# EAGLE design transf_auto7 (EAGLE 5.04)
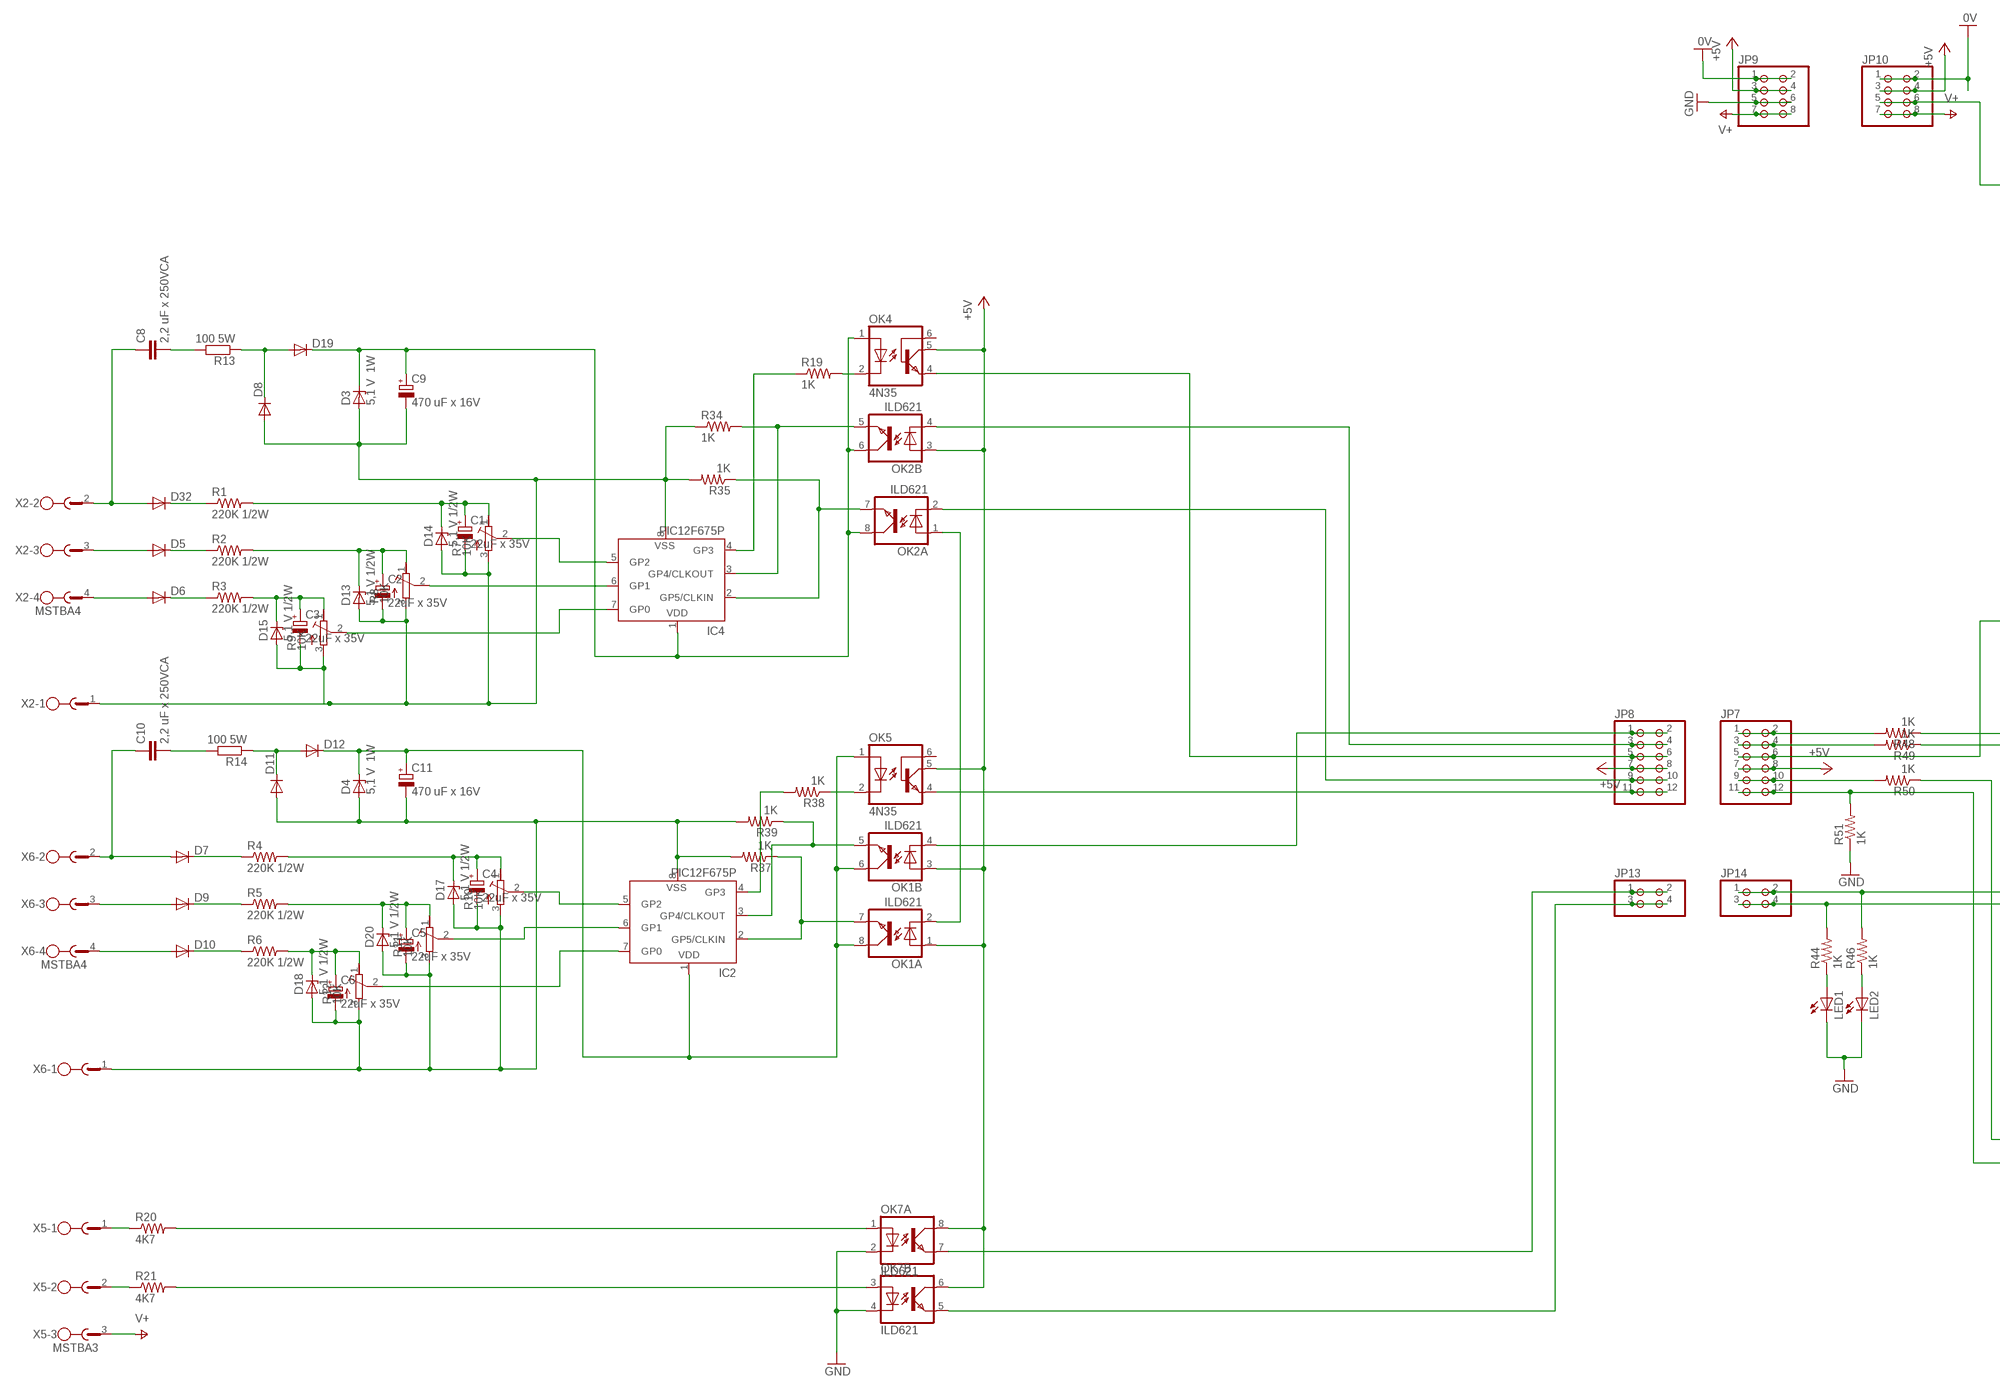
[diagram p0: schematic, sheet 1, part 1 of 2]
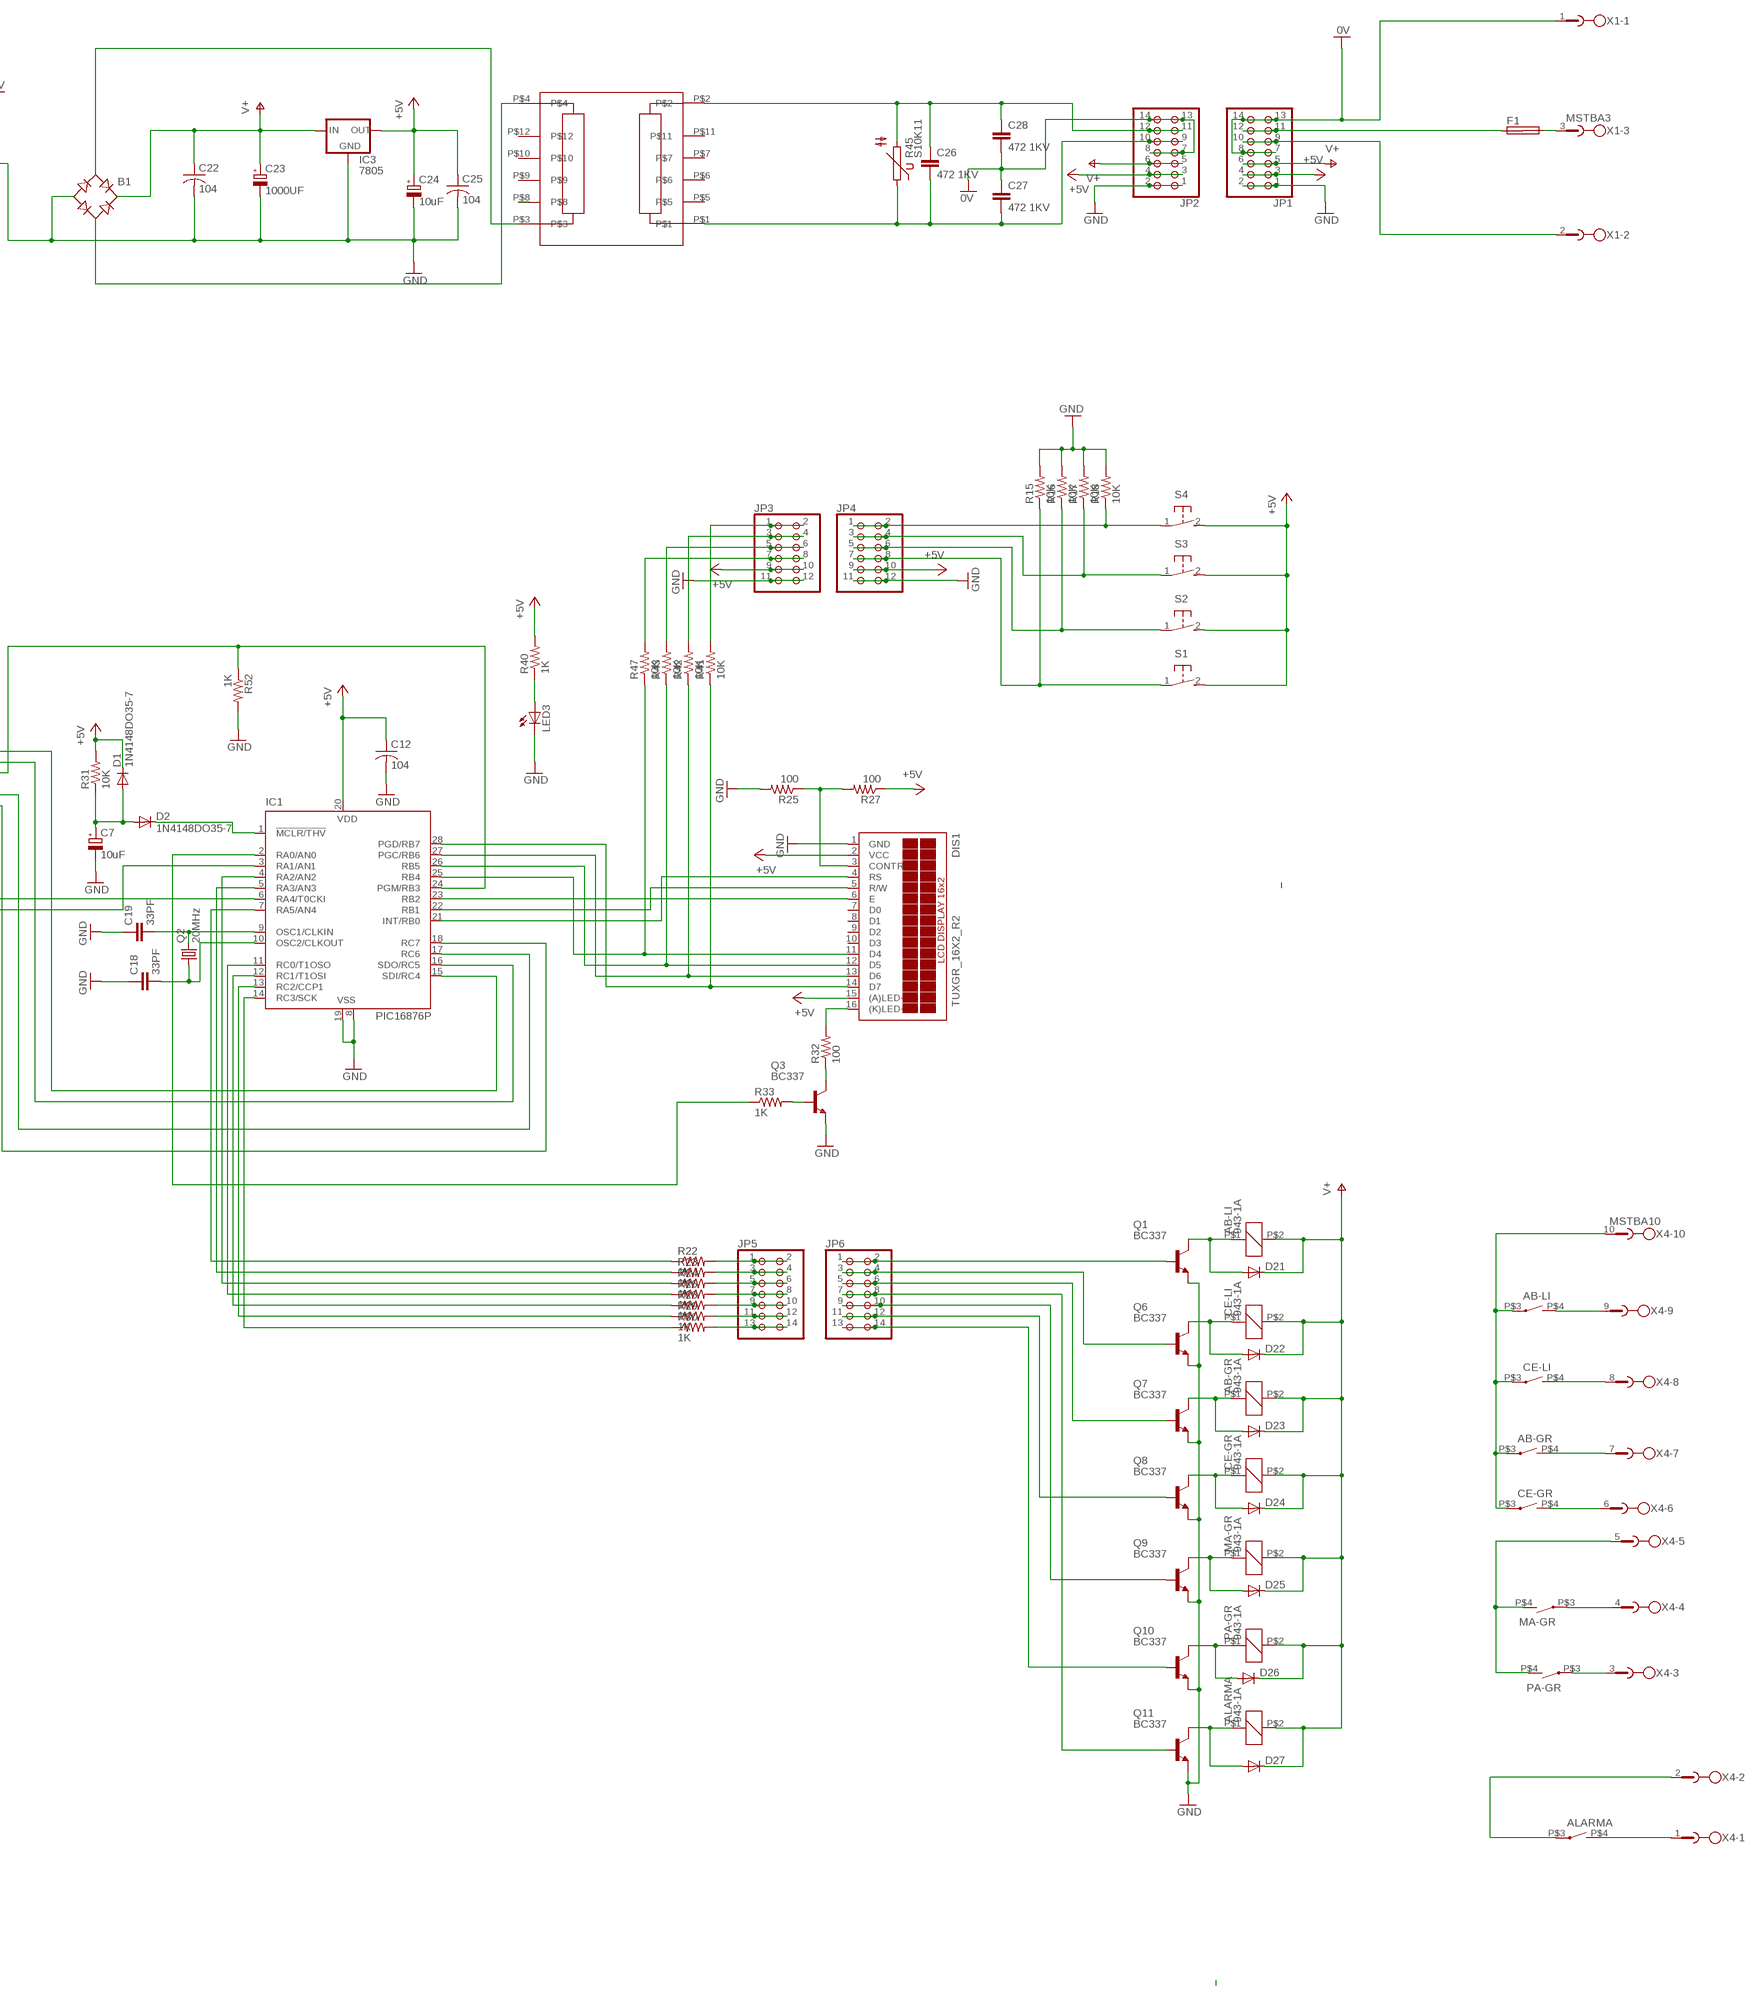
[diagram p1: schematic, sheet 1, part 2 of 2]

## Parts
AB-GR  943-1A  [943-1A]
AB-LI  943-1A  [943-1A]
ALARMA  943-1A  [943-1A]
B1  RB1A  [RB1A]
C1  22uF x 35V  CPOL-EUE2.5-6  [E2,5-6]
C2  22uF x 35V  CPOL-EUE2.5-6  [E2,5-6]
C3  22uF x 35V  CPOL-EUE2.5-6  [E2,5-6]
C4  22uF x 35V  CPOL-EUE2.5-6  [E2,5-6]
C5  22uF x 35V  CPOL-EUE2.5-6  [E2,5-6]
C6  22uF x 35V  CPOL-EUE2.5-6  [E2,5-6]
C7  10uF  CPOL-EUE2.5-6  [E2,5-6]
C8  2,2 uF x 250VCA  C-EU275-093X316  [C275-093X316]
C9  470 uF x 16V  CPOL-EUE3.5-8  [E3,5-8]
C10  2,2 uF x 250VCA  C-EU275-093X316  [C275-093X316]
C11  470 uF x 16V  CPOL-EUE3.5-8  [E3,5-8]
C12  104  C-US050-025X075  [C050-025X075]
C18  33PF  C-EU050-024X044  [C050-024X044]
C19  33PF  C-EU050-024X044  [C050-024X044]
C22  104  C-US050-025X075  [C050-025X075]
C23  1000UF  CPOL-EUE5-13  [E5-13]
C24  10uF  CPOL-EUE2.5-6  [E2,5-6]
C25  104  C-US050-025X075  [C050-025X075]
C26  472 1KV  C-EU050-025X075  [C050-025X075]
C27  472 1KV  C-EU050-025X075  [C050-025X075]
C28  472 1KV  C-EU050-025X075  [C050-025X075]
CE-GR  943-1A  [943-1A]
CE-LI  943-1A  [943-1A]
D1  1N4148DO35-7  [DO35-7]
D2  1N4148DO35-7  [DO35-7]
D3  5,1 V 1W  ZENER-DIODEZD-5  [ZDIO-5]
D4  5,1 V 1W  ZENER-DIODEZD-5  [ZDIO-5]
D5  DIODE-SOD80C  [SOD80C]
D6  DIODE-SOD80C  [SOD80C]
D7  DIODE-SOD80C  [SOD80C]
D8  DIODE-SOD80C  [SOD80C]
D9  DIODE-SOD80C  [SOD80C]
D10  DIODE-SOD80C  [SOD80C]
D11  DIODE-SOD80C  [SOD80C]
D12  DIODE-SOD80C  [SOD80C]
D13  5,1 V 1/2W  ZENER-DIODEZD-5  [ZDIO-5]
D14  5,1 V 1/2W  ZENER-DIODEZD-5  [ZDIO-5]
D15  5,1 V 1/2W  ZENER-DIODEZD-5  [ZDIO-5]
D17  5,1 V 1/2W  ZENER-DIODEZD-5  [ZDIO-5]
D18  5,1 V 1/2W  ZENER-DIODEZD-5  [ZDIO-5]
D19  DIODE-SOD80C  [SOD80C]
D20  5,1 V 1/2W  ZENER-DIODEZD-5  [ZDIO-5]
D21  DIODE-SOD80C  [SOD80C]
D22  DIODE-SOD80C  [SOD80C]
D23  DIODE-SOD80C  [SOD80C]
D24  DIODE-SOD80C  [SOD80C]
D25  DIODE-SOD80C  [SOD80C]
D26  DIODE-SOD80C  [SOD80C]
D27  DIODE-SOD80C  [SOD80C]
D32  DIODE-SOD80C  [SOD80C]
DIS1  TUXGR_16X2_R2  [TUXGR_16X2_R2]
F1  SHK20Q  [SHK20Q]
IC1  PIC16876P  [DIL28-3]
IC2  PIC12F675P  [DIL8]
IC3  7805  78XXS  [78XXS]
IC4  PIC12F675P  [DIL8]
JP1  PINHD-2X7  [2X07]
JP2  PINHD-2X7  [2X07]
JP3  PINHD-2X6  [2X06]
JP4  PINHD-2X6  [2X06]
JP5  PINHD-2X7  [2X07]
JP6  PINHD-2X7  [2X07]
JP7  PINHD-2X6  [2X06]
JP8  PINHD-2X6  [2X06]
JP9  PINHD-2X4  [2X04]
JP10  PINHD-2X4  [2X04]
JP13  PINHD-2X2  [2X02]
JP14  PINHD-2X2  [2X02]
LED1  LED5MM  [LED5MM]
LED2  LED5MM  [LED5MM]
LED3  LED5MM  [LED5MM]
MA-GR  943-1A  [943-1A]
OK1  ILD621  [DIL08]
OK2  ILD621  [DIL08]
OK4  4N35  [DIL06]
OK5  4N35  [DIL06]
OK7  ILD621  [DIL08]
PA-GR  943-1A  [943-1A]
Q1  BC337  [TO92]
Q2  20MHz  CRYTALHC49U70  [HC49U70]
Q3  BC337  [TO92]
Q6  BC337  [TO92]
Q7  BC337  [TO92]
Q8  BC337  [TO92]
Q9  BC337  [TO92]
Q10  BC337  [TO92]
Q11  BC337  [TO92]
R1  220K 1/2W  R-US_0204/5  [0204/5]
R2  220K 1/2W  R-US_0204/5  [0204/5]
R3  220K 1/2W  R-US_0204/5  [0204/5]
R4  220K 1/2W  R-US_0204/5  [0204/5]
R5  220K 1/2W  R-US_0204/5  [0204/5]
R6  220K 1/2W  R-US_0204/5  [0204/5]
R7  10K  R-TRIMMT93YA  [RTRIMT93YA]
R8  10K  R-TRIMMT93YA  [RTRIMT93YA]
R9  10K  R-TRIMMT93YA  [RTRIMT93YA]
R10  10K  R-TRIMMT93YA  [RTRIMT93YA]
R11  10K  R-TRIMMT93YA  [RTRIMT93YA]
R12  10K  R-TRIMMT93YA  [RTRIMT93YA]
R13  100 5W  R-EU_0309/12  [0309/12]
R14  100 5W  R-EU_0309/12  [0309/12]
R15  10K  R-US_0204/5  [0204/5]
R16  10K  R-US_0204/5  [0204/5]
R17  10K  R-US_0204/5  [0204/5]
R18  10K  R-US_0204/5  [0204/5]
R19  1K  R-US_0204/5  [0204/5]
R20  4K7  R-US_0204/5  [0204/5]
R21  4K7  R-US_0204/5  [0204/5]
R22  1K  R-US_0204/5  [0204/5]
R23  1K  R-US_0204/5  [0204/5]
R24  1K  R-US_0204/5  [0204/5]
R25  100  R-US_0204/5  [0204/5]
R26  1K  R-US_0204/5  [0204/5]
R27  100  R-US_0204/5  [0204/5]
R28  1K  R-US_0204/5  [0204/5]
R29  1K  R-US_0204/5  [0204/5]
R30  1K  R-US_0204/5  [0204/5]
R31  10K  R-US_0204/5  [0204/5]
R32  100  R-US_0204/5  [0204/5]
R33  1K  R-US_0204/5  [0204/5]
R34  1K  R-US_0204/5  [0204/5]
R35  1K  R-US_0204/5  [0204/5]
R37  1K  R-US_0204/5  [0204/5]
R38  1K  R-US_0204/5  [0204/5]
R39  1K  R-US_0204/5  [0204/5]
R40  1K  R-US_0204/5  [0204/5]
R41  10K  R-US_0204/7  [0204/7]
R42  10K  R-US_0204/7  [0204/7]
R43  10K  R-US_0204/7  [0204/7]
R44  1K  R-US_0204/5  [0204/5]
R45  S10K11  [S10K11]
R46  1K  R-US_0204/5  [0204/5]
R47  10K  R-US_0204/7  [0204/7]
R48  1K  R-US_0204/5  [0204/5]
R49  1K  R-US_0204/5  [0204/5]
R50  1K  R-US_0204/5  [0204/5]
R51  1K  R-US_0204/5  [0204/5]
R52  1K  R-US_0204/5  [0204/5]
S1  31-XX  [B3F-31XX]
S2  31-XX  [B3F-31XX]
S3  31-XX  [B3F-31XX]
S4  31-XX  [B3F-31XX]
U$18  EI25_12/0  [EI25_12/0-PLACA]
X1  MSTBA3  [MSTBA3]
X2  MSTBA4  [MSTBA4]
X4  MSTBA10  [MSTBA10]
X5  MSTBA3  [MSTBA3]
X6  MSTBA4  [MSTBA4]

## Nets
0V: C27.1 C28.2 JP1.7 JP1.8 JP1.13 JP1.14 JP2.7 JP2.8 JP2.13 JP2.14 JP9.1 JP9.2 JP10.1 JP10.2 X1.1
+5V: C12.1 C24.+ C25.1 D1.C DIS1.2(VCC) DIS1.15((A)LED-) IC1.20(VDD) IC3.OUT JP1.3 JP1.4 JP2.3 JP2.4 JP3.9 JP3.10 JP4.9 JP4.10 JP7.7 JP7.8 JP8.7 JP8.8 JP9.3 JP9.4 JP10.3 JP10.4 OK1.1(A:A) OK1.3(B:A) OK2.3(B:A) OK4.5(COL) OK5.5(COL) OK7.6(B:COL) OK7.8(A:COL) R27.1 R31.2 R40.2 S1.2(S) S2.2(S) S3.2(S) S4.2(S)
GND: B1.- C7.- C12.2 C18.1 C19.1 C22.2 C23.- C24.- C25.2 DIS1.1(GND) IC1.8(VSS) IC1.19(VSS) IC3.GND JP1.1 JP1.2 JP2.1 JP2.2 JP3.11 JP3.12 JP4.11 JP4.12 JP9.5 JP9.6 JP10.5 JP10.6 LED1.K(C) LED2.K(C) LED3.K(C) OK7.2(A:C) OK7.4(B:C) Q1.1(E) Q3.1(E) Q6.1(E) Q7.1(E) Q8.1(E) Q9.1(E) Q10.1(E) Q11.1(E) R15.2 R16.2 R17.2 R18.2 R25.2 R51.1 R52.2
N$1: C1.+ D14.C R1.2 R7.1(A)
N$2: C1.- C2.- C3.- C9.- D3.A D8.A D13.A D14.A D15.A IC4.8(VSS) R7.3(E) R8.3(E) R9.3(E) R34.1 R35.2 X2.1
N$3: F1.2A X1.3
N$4: C2.+ D13.C R2.2 R8.1(A)
N$5: IC4.5(GP2) R7.2(S)
N$6: C3.+ D15.C R3.2 R9.1(A)
N$7: IC4.7(GP0) R9.2(S)
N$8: D5.A X2.3
N$9: D6.C R3.1
N$10: D6.A X2.4
N$11: D5.C R2.1
N$12: C8.1 D32.A X2.2
N$13: D32.C R1.1
N$14: D9.A X6.3
N$15: IC4.6(GP1) R8.2(S)
N$16: C4.+ D17.C R4.2 R10.1(A)
N$17: B1.AC1 U$18.P$3
N$18: OK4.2(C) R19.2
N$19: IC4.3(GP4/CLKOUT) OK2.5(B:EMIT) R34.2
N$20: IC4.2(GP5/CLKIN) OK2.7(A:EMIT) R35.1
N$21: C9.+ D3.C D19.C IC4.1(VDD) OK2.6(B:COL) OK2.8(A:COL) OK4.1(A)
N$22: C4.- C5.- C6.- C11.- D4.A D11.A D17.A D18.A D20.A IC2.8(VSS) R10.3(E) R11.3(E) R12.3(E) R37.2 R39.2 X6.1
N$23: JP8.5 JP8.6 OK4.4(EMI)
N$24: B1.AC2 U$18.P$4
N$25: C5.+ D20.C R5.2 R11.1(A)
N$26: C8.2 R13.2
N$27: C6.+ D18.C R6.2 R12.1(A)
N$28: D8.C D19.A R13.1
N$29: JP8.3 JP8.4 OK2.4(B:C)
N$30: D10.C R6.1
N$31: D9.C R5.1
N$32: AB-GR.P$3(P) AB-LI.P$3(P) CE-GR.P$3(P) CE-LI.P$3(P) X4.10
N$33: D7.C R4.1
N$34: JP8.9 JP8.10 OK2.2(A:C)
N$35: C10.1 D7.A X6.2
N$36: D10.A X6.4
N$37: JP3.1 JP3.2 R41.2
N$38: OK5.2(C) R38.1
N$39: D2.C IC1.1(!MCLR/THV)
N$40: C18.2 IC1.10(OSC2/CLKOUT) Q2.1
N$41: JP8.1 JP8.2 OK1.4(B:C)
N$42: C19.2 IC1.9(OSC1/CLKIN) Q2.2
N$43: JP6.1 JP6.2 Q1.2(B)
N$44: DIS1.16((K)LED-) R32.2
N$45: DIS1.14(D7) IC1.28(PGD/RB7) R41.1
N$47: DIS1.13(D6) IC1.27(PGC/RB6) R42.1
N$48: U$18.P$8
N$49: AB-GR.P$4(S) X4.7
N$51: AB-LI.P$4(S) X4.9
N$52: CE-LI.P$4(S) X4.8
N$53: MA-GR.P$4(S) PA-GR.P$4(S) X4.5
N$54: JP6.3 JP6.4 Q6.2(B)
N$55: JP6.5 JP6.6 Q7.2(B)
N$56: JP6.7 JP6.8 Q11.2(B)
N$57: IC2.5(GP2) R10.2(S)
N$58: CE-GR.P$4(S) X4.6
N$59: C7.+ D1.A D2.A R31.1
N$60: C26.1 C28.1 JP2.11 JP2.12 R45.2 U$18.P$2
N$61: JP6.9 JP6.10 Q9.2(B)
N$62: MA-GR.P$3(P) X4.4
N$63: JP13.1 JP13.2 OK7.7(A:EMIT)
N$64: IC2.7(GP0) R12.2(S)
N$66: JP1.9 JP1.10 X1.2
N$67: LED1.A R44.1
N$68: DIS1.3(CONTR) R25.1 R27.2
N$69: JP3.7 JP3.8 R47.2
N$70: JP3.5 JP3.6 R43.2
N$71: DIS1.12(D5) IC1.26(RB5) R43.1
N$72: DIS1.11(D4) IC1.25(RB4) R47.1
N$74: DIS1.4(RS) IC1.21(INT/RB0)
N$75: DIS1.5(R/W) IC1.22(RB1)
N$76: DIS1.6(E) IC1.23(RB2)
N$77: IC1.17(RC6) R50.1
N$78: IC1.16(SDO/RC5) R49.1
N$79: IC1.15(SDI/RC4) R48.1
N$80: F1.1A JP1.11 JP1.12
N$82: IC1.18(RC7) JP7.11 JP7.12 R51.2
N$83: IC4.4(GP3) R19.1
N$84: JP5.1 JP5.2 R22.2
N$85: LED2.A R46.1
N$86: Q3.3(C) R32.1
N$87: Q3.2(B) R33.2
N$88: C26.2 C27.2 JP2.9 JP2.10 R45.1 U$18.P$1
N$90: PA-GR.P$3(P) X4.3
N$92: ALARMA.P$3(P) X4.2
N$93: JP6.11 JP6.12 Q8.2(B)
N$94: R21.1 X5.2
N$95: JP6.13 JP6.14 Q10.2(B)
N$96: IC1.14(RC3/SCK) R30.1
N$97: IC1.13(RC2/CCP1) R29.1
N$98: IC1.12(RC1/T1OSI) R28.1
N$99: IC1.11(RC0/T1OSO) R26.1
N$100: IC1.4(RA2/AN2) R24.1
N$101: IC1.5(RA3/AN3) R23.1
N$102: JP4.7 JP4.8 R15.1 S1.1(P)
N$103: JP4.5 JP4.6 R16.1 S2.1(P)
N$104: JP4.3 JP4.4 R17.1 S3.1(P)
N$105: JP4.1 JP4.2 R18.1 S4.1(P)
N$106: IC1.7(RA5/AN4) R22.1
N$107: R20.1 X5.1
N$118: IC2.2(GP5/CLKIN) OK1.7(A:EMIT) R37.1
N$119: IC2.4(GP3) R38.2
N$120: ALARMA.P$4(S) X4.1
N$121: IC2.3(GP4/CLKOUT) OK1.5(B:EMIT) R39.1
N$122: OK7.1(A:A) R20.2
N$123: OK7.3(B:A) R21.2
N$124: ALARMA.P$1 D27.A Q11.3(C)
N$125: C11.+ D4.C D12.C IC2.1(VDD) OK1.6(B:COL) OK1.8(A:COL) OK5.1(A)
N$126: D11.C D12.A R14.1
N$127: C10.2 R14.2
N$128: D26.A PA-GR.P$1 Q10.3(C)
N$129: IC2.6(GP1) R11.2(S)
N$130: IC1.6(RA4/T0CKI) JP14.1 JP14.2 R46.2
N$133: D25.A MA-GR.P$1 Q9.3(C)
N$137: IC1.3(RA1/AN1) JP14.3 JP14.4 R44.2
N$138: CE-GR.P$1 D24.A Q8.3(C)
N$139: JP13.3 JP13.4 OK7.5(B:EMIT)
N$140: AB-GR.P$1 D23.A Q7.3(C)
N$141: JP5.3 JP5.4 R23.2
N$142: CE-LI.P$1 D22.A Q6.3(C)
N$143: JP5.5 JP5.6 R24.2
N$144: AB-LI.P$1 D21.A Q1.3(C)
N$145: JP5.7 JP5.8 R26.2
N$146: JP5.9 JP5.10 R28.2
N$147: JP5.11 JP5.12 R29.2
N$148: JP5.13 JP5.14 R30.2
N$149: OK1.2(A:C) OK2.1(A:A)
N$151: JP7.1 JP7.2 R48.2
N$152: IC1.2(RA0/AN0) R33.1
N$153: JP7.3 JP7.4 R49.2
N$154: JP7.9 JP7.10 R50.2
N$155: LED3.A R40.1
N$156: JP3.3 JP3.4 R42.2
N$157: JP8.11 JP8.12 OK5.4(EMI)
N$158: IC1.24(PGM/RB3) JP7.5 JP7.6 R52.1
V+: AB-GR.P$2 AB-LI.P$2 ALARMA.P$2 B1.+ C22.1 C23.+ CE-GR.P$2 CE-LI.P$2 D21.C D22.C D23.C D24.C D25.C D26.C D27.C IC3.IN JP1.5 JP1.6 JP2.5 JP2.6 JP9.7 JP9.8 JP10.7 JP10.8 MA-GR.P$2 PA-GR.P$2 X5.3
Unconnected: DIS1.7(D0) DIS1.8(D1) DIS1.9(D2) DIS1.10(D3) F1.1B F1.2B OK4.6(BAS) OK5.6(BAS) U$18.P$5 U$18.P$6 U$18.P$7 U$18.P$9 U$18.P$10 U$18.P$11 U$18.P$12

## Library data of the parts
AB-GR AB-LI ALARMA CE-GR CE-LI MA-GR PA-GR = relay:943-1A
B1 = rectifier:RB1A: RECTIFIER 1 A
C1-C7 C9 C11 C23 C24 = rcl:CPOL-EU: POLARIZED CAPACITOR, European symbol
C8 C10 C18 C19 C26-C28 = rcl:C-EU: CAPACITOR, European symbol
C12 C22 C25 = rcl:C-US: CAPACITOR, American symbol
D1 D2 = diode:1N4148: DIODE high speed (Philips)
D3 D4 D13-D15 D17 D18 D20 = diode:ZENER-DIODE: Z-Diode
D5-D12 D19 D21-D27 D32 = diode:DIODE-: DIODE
DIS1 = display-lcd:TUXGR_16X2_R2: Tuxgraphics LCD display 16x2 characters reflective, without background light Source: tuxgr_12x2_r2.pdf
F1 = fuse:SHK20Q: FUSE HOLDER 5 x 20 mm, SH contact, E1207 Buerklin 64G6061
IC1 = microchip:PIC16*876: MICROCONTROLLER flash type
IC2 IC4 = microchip:PIC12F6*: Data Sheet 8-Pin FLASH-Based 8-Bit CMOS Microcontrollers Source: http://www.microchip.com .. 41190c.pdf
IC3 = v-reg:78XXS: VOLTAGE REGULATOR
JP1 JP2 JP5 JP6 = pinhead:PINHD-2X7: PIN HEADER
JP3 JP4 JP7 JP8 = pinhead:PINHD-2X6: PIN HEADER
JP9 JP10 = pinhead:PINHD-2X4: PIN HEADER
JP13 JP14 = pinhead:PINHD-2X2: PIN HEADER
LED1-LED3 = led:LED: LED OSRAM: - CHIPLED LG R971, LG N971, LY N971, LG Q971, LY Q971, LO R971, LY R971 LH N974, LH R974 LS Q976, LO Q976, LY Q976 LO Q996 - Hyper CHIPLED LW Q18S LB Q993, LB Q99A, LB R99A - SideLED LS A670, LO A670, LY A670, LG A670, LP A670 LB A673, LV A673, LT A673, LW A673 LH A674 LY A675 LS A676, LA A676, LO A676, LY A676, LW A676 LS A679, LY A679, LG A679 - Hyper Micro SIDELED® LS Y876, LA Y876, LO Y876, LY Y876 LT Y87S - SmartLED LW L88C, LW L88S LB L89C, LB L89S, LG L890 LS L89K, LO L89K, LY L89K LS L896, LA L896, LO L896, LY L896 - TOPLED LS T670, LO T670, LY T670, LG T670, LP T670 LSG T670, LSP T670, LSY T670, LOP T670, LYG T670 LG T671, LOG T671, LSG T671 LB T673, LV T673, LT T673, LW T673 LH T674 LS T676, LA T676, LO T676, LY T676, LB T676, LH T676, LSB T676, LW T676 LB T67C, LV T67C, LT T67C, LS T67K, LO T67K, LY T67K, LW E67C LS E67B, LA E67B, LO E67B, LY E67B, LB E67C, LV E67C, LT E67C LW T67C LS T679, LY T679, LG T679 LS T770, LO T770, LY T770, LG T770, LP T770 LB T773, LV T773, LT T773, LW T773 LH T774 LS E675, LA E675, LY E675, LS T675 LS T776, LA T776, LO T776, LY T776, LB T776 LHGB T686 LT T68C, LB T68C - Hyper Mini TOPLED® LB M676 - Mini TOPLED Santana® LG M470 LS M47K, LO M47K, LY M47K Source: http://www.osram.convergy.de LUXEON: - LUMILED® LXK2-PW12-R00, LXK2-PW12-S00, LXK2-PW14-U00, LXK2-PW14-V00 LXK2-PM12-R00, LXK2-PM12-S00, LXK2-PM14-U00 LXK2-PE12-Q00, LXK2-PE12-R00, LXK2-PE12-S00, LXK2-PE14-T00, LXK2-PE14-U00 LXK2-PB12-K00, LXK2-PB12-L00, LXK2-PB12-M00, LXK2-PB14-N00, LXK2-PB14-P00, LXK2-PB14-Q00 LXK2-PR12-L00, LXK2-PR12-M00, LXK2-PR14-Q00, LXK2-PR14-R00 LXK2-PD12-Q00, LXK2-PD12-R00, LXK2-PD12-S00 LXK2-PH12-R00, LXK2-PH12-S00 LXK2-PL12-P00, LXK2-PL12-Q00, LXK2-PL12-R00 Source: www.luxeon.com KINGBRIGHT: KA-3528ASYC Source: www.kingbright.com
OK1 OK2 OK7 = optocoupler:ILD621: SIEMENS OPTO COUPLER
OK4 OK5 = optocoupler:4N35: MOTOROLA OPTO COUPLER
Q1 Q3 Q6-Q11 = transistor-npn:BC337*: NPN Transistor
Q2 = crystal:CRYTAL: CRYSTAL
R1-R6 R15-R35 R37-R44 R46-R52 = rcl:R-US_: RESISTOR, American symbol
R7-R12 = rcl:R-TRIMM: Trimm resistor
R13 R14 = rcl:R-EU_: RESISTOR, European symbol
R45 = varistor:S10K11: VARISTOR
S1-S4 = switch-omron:31-XX: OMRON SWITCH
U$18 = trafo:EI25_12/0
X1 X5 = con-phoenix-508:MSTBA3: PHOENIX
X2 X6 = con-phoenix-508:MSTBA4: PHOENIX
X4 = con-phoenix-508:MSTBA10: PHOENIX

## Board
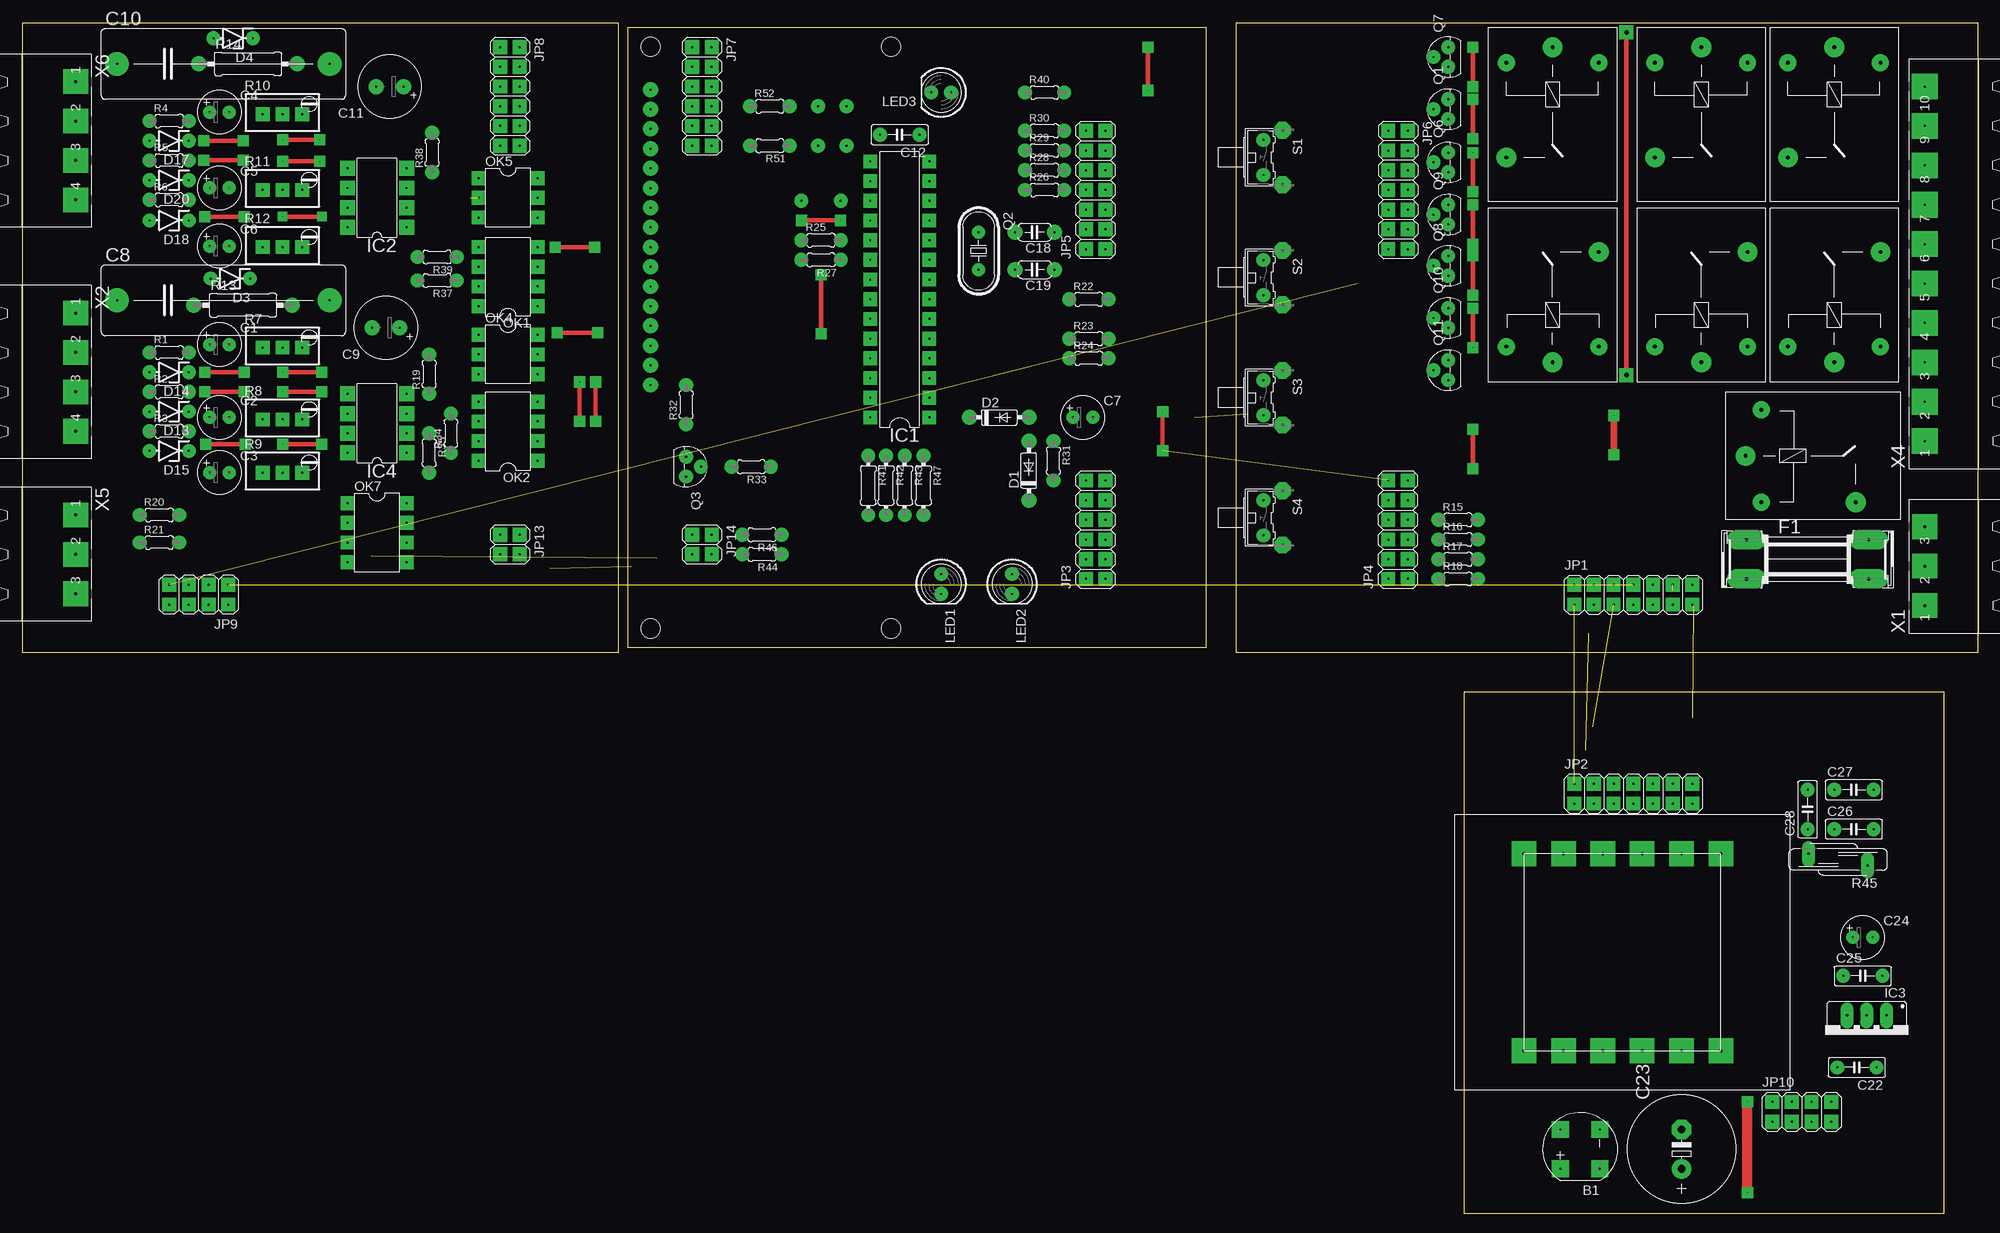
[diagram p2: board, top side]
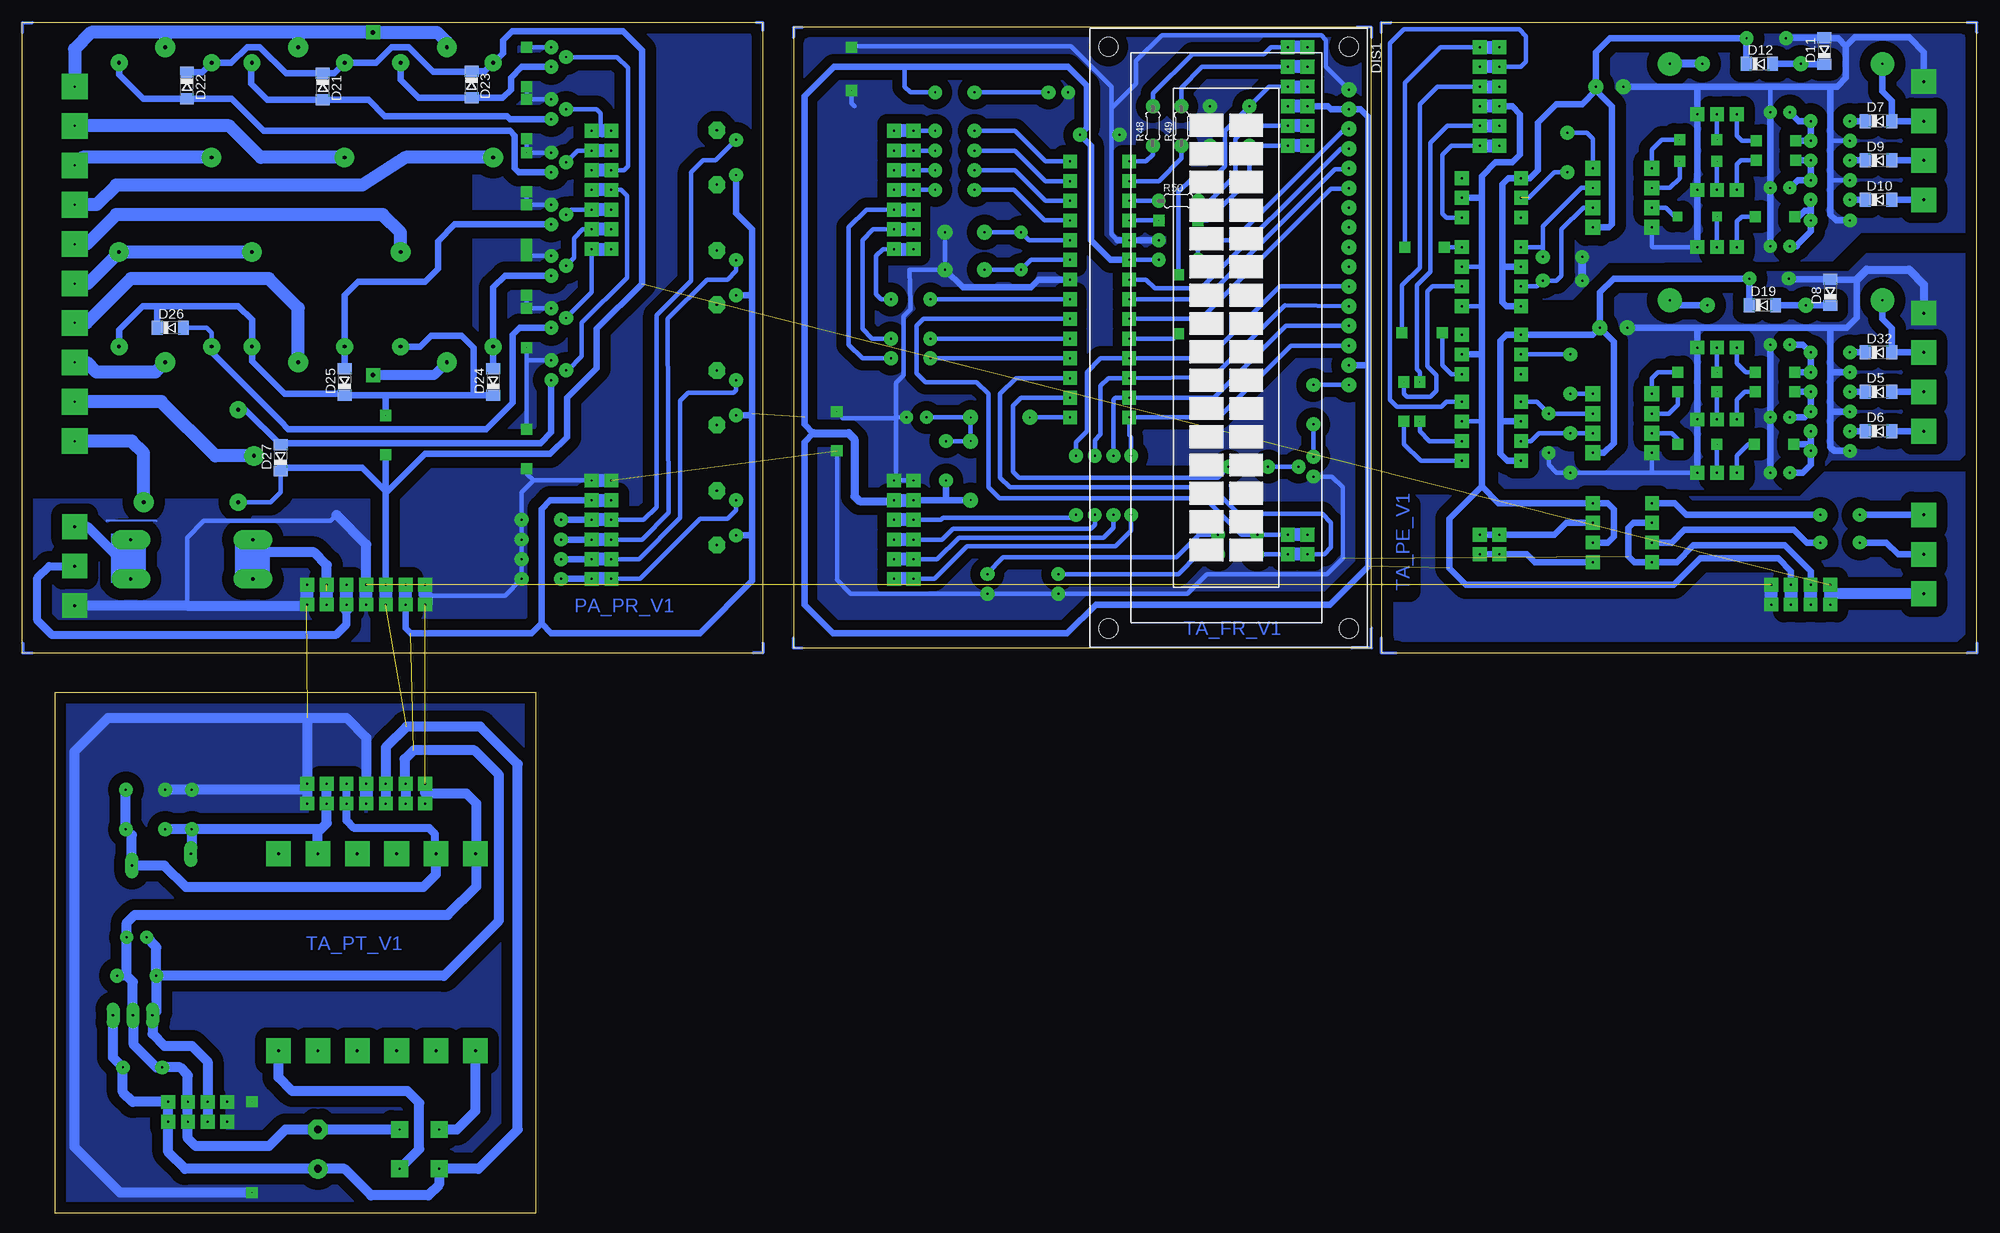
[diagram p3: board, bottom side, seen from below]

Size 252.22 x 153.54 mm. Coordinates in mm from the lower left corner, seen from the top.
Outline: 0,72.26 0,153.54 76.84,153.54 76.84,72.26 0,72.26
Outline: 78.1,72.9 78.1,152.91 152.65,152.91 152.65,72.9 78.1,72.9
Outline: 156.59,72.26 156.59,153.54 252.22,153.54 252.22,72.26 156.59,72.26
Outline: 185.93,67.18 185.93,0 247.9,0 247.9,67.18 185.93,67.18
Copper layers (1*16): Top 0.035mm / dielectric 1.5mm / Bottom 0.035mm
Design rules "default": minimum track width 10mil, minimum drill 24mil, track to track 8mil, track to pad 8mil, pad to pad 8mil, via to via 8mil, smd to smd 8mil, copper to edge 40mil, drill to drill 8mil, minimum pad ring 10mil, minimum via ring 8mil, stop-mask expansion 4mil, vias tented up to drill 0mil, thermal gap 10mil

### Footprints (pad centres in the part's own frame; a part is rotated, then mirrored left to right if it is on the bottom)
943-1A = drill 0.5 pad 2.184 round: P$1 -6.858,5.969; P$2 -6.858,-5.969 | drill 0.5 pad 2.54 round: P$3 -8.89,0; P$4 5.334,-5.969
RB1A = drill 0.254 pad 2.184 square: + -2.54,2.54; - 2.54,-2.54; AC1 2.54,2.54; AC2 -2.54,-2.54
E2,5-6 = drill 0.254 pad 1.676 round: + -1.27,0; - 1.27,0
C275-093X316 = drill 0.254 pad 3.048 round: 1 -13.716,0; 2 13.716,0
E3,5-8 = drill 0.254 pad 1.93 round: + -1.778,0; - 1.778,0
C050-025X075 = drill 0.254 pad 1.778 round: 1 -2.54,0; 2 2.54,0
C050-024X044 = drill 0.254 pad 1.93 round: 1 -2.54,0; 2 2.54,0
E5-13 = drill 1.016 pad 2.54 round: + -2.54,0 | drill 1.016 pad 2.54 octagon: - 2.54,0
DO35-7 = drill 0.2 pad 1.93 round: A 3.81,0; C -3.81,0
ZDIO-5 = drill 0.254 pad 1.778 round: A 2.54,0; C -2.54,0
SOD80C = smd 1.4 x 1.8: A 1.7,0; C -1.7,0
TUXGR_16X2_R2 = drill 0.254 pad 1.93 round: 1 -32,15.5; 2 -29.46,15.5; 3 -26.92,15.5; 4 -24.38,15.5; 5 -21.84,15.5; 6 -19.3,15.5; 7 -16.76,15.5; 8 -14.22,15.5; 9 -11.68,15.5; 10 -9.14,15.5; 11 -6.6,15.5; 12 -4.06,15.5; 13 -1.52,15.5; 14 1.02,15.5; 15 3.56,15.5; 16 6.1,15.5 | hole 2.5: -37.5,-15.5; 37.5,-15.5; -37.5,15.5; 37.5,15.5
SHK20Q = drill 0.406 pad 2.54 long: 1A -7.874,2.54; 1B -7.874,-2.54; 2A 7.874,2.54; 2B 7.874,-2.54
DIL28-3 = drill 0.254 pad 1.778 square: 1 -16.51,-3.81; 2 -13.97,-3.81; 3 -11.43,-3.81; 4 -8.89,-3.81; 5 -6.35,-3.81; 6 -3.81,-3.81; 7 -1.27,-3.81; 8 1.27,-3.81; 9 3.81,-3.81; 10 6.35,-3.81; 11 8.89,-3.81; 12 11.43,-3.81; 13 13.97,-3.81; 14 16.51,-3.81; 15 16.51,3.81; 16 13.97,3.81; 17 11.43,3.81; 18 8.89,3.81; 19 6.35,3.81; 20 3.81,3.81; 21 1.27,3.81; 22 -1.27,3.81; 23 -3.81,3.81; 24 -6.35,3.81; 25 -8.89,3.81; 26 -11.43,3.81; 27 -13.97,3.81; 28 -16.51,3.81
DIL8 = drill 0.254 pad 1.93 square: 1 -3.81,-3.81; 2 -1.27,-3.81; 3 1.27,-3.81; 4 3.81,-3.81; 5 3.81,3.81; 6 1.27,3.81; 7 -1.27,3.81; 8 -3.81,3.81
78XXS = drill 0.305 pad 1.676 long: GND 0,-2.54; IN -2.54,-2.54; OUT 2.54,-2.54
2X07 = drill 0.254 pad 1.778 square: 1 -7.62,-1.27; 2 -7.62,1.27; 3 -5.08,-1.27; 4 -5.08,1.27; 5 -2.54,-1.27; 6 -2.54,1.27; 7 0,-1.27; 8 0,1.27; 9 2.54,-1.27; 10 2.54,1.27; 11 5.08,-1.27; 12 5.08,1.27; 13 7.62,-1.27; 14 7.62,1.27
2X06 = drill 0.254 pad 1.778 square: 1 -6.35,-1.27; 2 -6.35,1.27; 3 -3.81,-1.27; 4 -3.81,1.27; 5 -1.27,-1.27; 6 -1.27,1.27; 7 1.27,-1.27; 8 1.27,1.27; 9 3.81,-1.27; 10 3.81,1.27; 11 6.35,-1.27; 12 6.35,1.27
2X04 = drill 0.254 pad 1.778 square: 1 -3.81,-1.27; 2 -3.81,1.27; 3 -1.27,-1.27; 4 -1.27,1.27; 5 1.27,-1.27; 6 1.27,1.27; 7 3.81,-1.27; 8 3.81,1.27
2X02 = drill 0.254 pad 1.778 square: 1 -1.27,-1.27; 2 -1.27,1.27; 3 1.27,-1.27; 4 1.27,1.27
LED5MM = drill 0.254 pad 1.778 round: A -1.27,0; K 1.27,0
DIL08 = drill 0.254 pad 1.778 square: 1 -3.81,-3.81; 2 -1.27,-3.81; 3 1.27,-3.81; 4 3.81,-3.81; 5 3.81,3.81; 6 1.27,3.81; 7 -1.27,3.81; 8 -3.81,3.81
DIL06 = drill 0.254 pad 1.778 square: 1 -2.54,-3.81; 2 0,-3.81; 3 2.54,-3.81; 4 2.54,3.81; 5 0,3.81; 6 -2.54,3.81
TO92 = drill 0.254 pad 1.778 round: 1 1.27,0; 2 0,1.905; 3 -1.27,0
HC49U70 = drill 0.254 pad 1.676 round: 1 -2.413,0; 2 2.413,0
0204/5 = drill 0.254 pad 1.778 round: 1 -2.54,0; 2 2.54,0
RTRIMT93YA = drill 0.254 pad 1.778 square: 1 0,-2.54; 2 0,0; 3 0,2.54
0309/12 = drill 0.254 pad 1.93 round: 1 -6.35,0; 2 6.35,0
0204/7 = drill 0.254 pad 1.778 round: 1 -3.81,0; 2 3.81,0
S10K11 = drill 0.305 pad 1.676 long: 1 -0.762,-3.81; 2 0.762,3.81
B3F-31XX = drill 0.254 pad 1.778 round: 1 -2.261,-1.245; 2 2.261,-1.245 | drill 0.305 pad 2.159 octagon: 3 -3.505,1.245; 4 3.505,1.245
EI25_12/0-PLACA = drill 0.381 pad 3.175 square: P$1 -12.7,-7.62; P$2 -12.7,7.62; P$3 12.7,-12.7; P$4 12.7,12.7; P$5 -12.7,12.7; P$6 -12.7,-12.7; P$7 -12.7,-2.54; P$8 -12.7,2.54; P$9 12.7,-7.62; P$10 12.7,-2.54; P$11 12.7,2.54; P$12 12.7,7.62
MSTBA3 = drill 0.381 pad 3.175 square: 1 -5.08,5.08; 2 0,5.08; 3 5.08,5.08
MSTBA4 = drill 0.381 pad 3.175 square: 1 -7.62,5.08; 2 -2.54,5.08; 3 2.54,5.08; 4 7.62,5.08
MSTBA10 = drill 0.254 pad 3.302 square: 1 -22.86,5.08; 2 -17.78,5.08; 3 -12.7,5.08; 4 -7.62,5.08; 5 -2.54,5.08; 6 2.54,5.08; 7 7.62,5.08; 8 12.7,5.08; 9 17.78,5.08; 10 22.86,5.08

### Placement (x,y rotation side)
AB-GR  197.36,141.48 270 top
AB-LI  216.53,141.48 270 top
ALARMA  231.14,97.66 0 top
B1  200.91,8.26 90 top
C1  25.4,112.01 0 top
C2  25.4,102.62 0 top
C3  25.4,95.5 0 top
C4  25.4,141.99 0 top
C5  25.4,132.21 0 top
C6  25.4,124.71 0 top
C7  136.78,102.62 0 top
C8  25.91,117.73 0 top
C9  46.86,114.17 180 top
C10  25.91,148.21 0 top
C11  47.37,145.29 180 top
C12  113.16,139.06 180 top
C18  130.56,126.49 180 top
C19  130.56,121.67 180 top
C22  236.6,18.8 180 top
C23  214,8.26 90 top
C24  237.36,35.56 0 top
C25  237.36,30.61 0 top
C26  236.22,49.53 0 top
C27  236.22,54.61 0 top
C28  230.25,52.07 90 top
CE-GR  197.36,118.62 90 top
CE-LI  233.68,141.48 270 top
D1  129.79,95.76 90 top
D2  125.98,102.62 0 top
D3  26.8,120.52 180 top
D4  27.18,151.51 180 top
D5  12.7,105.92 0 bottom
D6  12.7,100.84 0 bottom
D7  12.7,140.84 0 bottom
D8  18.92,118.75 90 bottom
D9  12.7,135.76 0 bottom
D10  12.7,130.68 0 bottom
D11  19.69,149.86 90 bottom
D12  28.07,148.21 0 bottom
D13  18.92,103.38 180 top
D14  18.92,108.46 180 top
D15  18.92,98.3 180 top
D17  18.92,138.3 180 top
D18  18.92,128.02 180 top
D19  27.69,117.09 0 bottom
D20  18.92,133.22 180 top
D21  213.36,145.29 270 bottom
D22  230.89,145.42 270 bottom
D23  194.18,145.54 270 bottom
D24  191.39,107.19 90 bottom
D25  210.57,107.19 90 bottom
D26  233.04,114.17 0 bottom
D27  218.82,97.41 90 bottom
D32  12.7,111 0 bottom
DIS1  96.52,112.9 270 bottom
F1  230.25,84.33 0 top
IC1  113.16,119.13 90 top
IC2  45.72,130.94 90 top
IC3  237.87,22.99 180 top
IC4  45.72,101.85 90 top
JP1  207.77,79.76 0 top
JP2  207.77,54.1 0 top
JP3  138.43,88.14 90 top
JP4  177.42,88.14 90 top
JP5  138.43,131.95 90 top
JP6  177.42,131.95 270 top
JP7  87.63,144.02 270 top
JP8  62.87,144.02 270 top
JP9  22.73,79.76 180 top
JP10  229.49,13.08 0 top
JP13  62.87,86.23 270 top
JP14  87.63,86.23 270 top
LED1  118.49,81.15 270 top
LED2  127.64,81.15 270 top
LED3  118.49,144.53 180 top
MA-GR  216.53,118.62 90 top
OK1  62.61,120.78 90 top
OK2  62.61,100.84 90 top
OK4  62.61,110.74 270 top
OK5  62.61,130.94 270 top
OK7  45.72,87.76 270 top
PA-GR  233.68,118.62 90 top
Q1  183.9,142.37 90 top
Q2  123.32,124.08 270 top
Q3  85.6,96.27 270 top
Q6  183.9,135.51 90 top
Q7  183.9,149.1 90 top
Q8  183.9,122.17 90 top
Q9  183.9,128.78 90 top
Q10  183.9,115.44 90 top
Q11  183.9,108.71 90 top
R1  18.92,111 0 top
R2  18.92,105.92 0 top
R3  18.92,100.84 0 top
R4  18.92,140.84 0 top
R5  18.92,135.76 0 top
R6  18.92,130.68 0 top
R7  33.53,111.63 270 top
R8  33.53,102.36 270 top
R9  33.53,95.5 270 top
R10  33.53,141.73 270 top
R11  33.53,131.95 270 top
R12  33.53,124.59 270 top
R13  28.45,117.09 0 top
R14  29.08,148.21 0 top
R15  185.17,89.41 0 top
R16  185.17,86.87 0 top
R17  185.17,84.33 0 top
R18  185.17,81.79 0 top
R19  52.45,108.2 90 top
R20  17.65,90.04 0 top
R21  17.65,86.49 0 top
R22  137.54,117.86 0 top
R23  137.54,112.78 0 top
R24  137.54,110.24 0 top
R25  103,125.48 0 top
R26  131.83,131.95 0 top
R27  103,122.94 180 top
R28  131.83,134.49 0 top
R29  131.83,137.03 0 top
R30  131.83,139.57 0 top
R31  132.97,97.03 270 top
R32  85.6,104.27 90 top
R33  93.98,96.27 180 top
R34  55.24,100.58 90 top
R35  52.45,98.04 270 top
R37  53.47,120.27 180 top
R38  52.83,136.78 90 top
R39  53.47,123.32 180 top
R40  131.83,144.53 0 top
R41  109.09,93.85 270 top
R42  111.38,93.85 270 top
R43  113.79,93.85 270 top
R44  95.38,84.96 180 top
R45  234.19,45.59 90 top
R46  95.38,87.5 180 top
R47  116.21,93.85 270 top
R48  106.3,140.21 90 bottom
R49  102.62,140.21 90 bottom
R50  103,130.56 0 bottom
R51  96.39,137.67 180 top
R52  96.39,142.75 0 top
S1  161.29,136.14 270 top
S2  161.29,120.65 270 top
S3  161.29,105.16 270 top
S4  161.29,89.66 270 top
U$18  206.38,33.66 270 top
X1  250.44,83.44 90 top
X2  1.78,108.46 270 top
X4  250.44,122.43 90 top
X5  1.78,84.96 270 top
X6  1.78,138.3 270 top

### Tracks (layer width: path | path; a pad name or v marks a point on that pad's centre or on a via)
0V  (via drill 0.01 pad 1.42)  (2 unrouted)
  Top 1.27: v222.5,2.67 v222.5,14.35
  Bottom 0.254: 234.82,89.28 241.3,89.28
  Bottom 0.61: 211.58,90.04 212.34,89.28 228.73,89.28 230.89,87.12 230.89,78.36
  Bottom 1.27: C27.1 C28.2 215.39,54.61 JP2.14 | JP2.14 JP2.13 | X1.1 230.89,78.36 215.52,78.36 JP1.13 | v222.5,2.67 239.52,2.67 245.36,8.51 245.36,59.56 241.05,63.88 215.39,63.88 | JP2.8 207.77,61.34 210.31,63.88 215.39,63.88 | 215.39,63.88 JP2.14 | JP1.8 207.77,86.23 211.58,90.04
  Bottom 1.676: JP1.13 JP1.14 | JP2.8 JP2.7 | JP1.7 JP1.8 | JP9.2 JP9.1
  pour Bottom (isolate 1.422, no thermals): 1.4,95.5 19.69,95.5 22.86,92.33 44.96,92.33 75.82,92.58 75.82,73.28 3.05,73.28 1.4,74.93
  pour Bottom (isolate 1.422, no thermals): 252.22,72.26 252.22,92.08 207.39,92.08 207.39,72.26
  pour Bottom (isolate 1.422, no thermals): 185.93,67.18 185.93,0 248.03,0 248.03,67.18
+5V  (3 unrouted)
  Bottom 0.61: 157.99,87.38 158.01,87.4 | 157.99,103.12 158.22,102.89 | 157.99,118.49 158.09,118.39 | IC1.20 R27.1 | 139.83,91.82 JP3.9 | 133.1,91.95 132.97,92.08 | R40.2 137.54,144.53 138.3,145.29 138.3,147.57 138.56,147.83 | 63.88,122.05 OK1.3 | 63.88,116.97 OK1.1 | OK2.3 64.01,102.11 63.88,101.98 | 63.88,112.14 64.01,112.01
  Bottom 0.813: S1.2 160.05,128.93 157.99,126.87 157.99,118.49 157.99,103.12 157.99,87.38 157.99,81.53 164.72,74.8 183.9,74.8 185.17,76.07 | 158.01,87.4 S4.2 | 158.22,102.89 S3.2 | 158.09,118.39 S2.2 | JP8.7 59.94,142.75 58.93,141.73 58.93,136.53 59.94,135.51 62.1,135.51 63.88,133.73 63.88,130.94 | JP4.9 184.02,91.95 185.17,90.8 185.17,76.07 | JP1.3 202.69,75.44 202.06,74.8 186.44,74.8 185.17,76.07 | IC1.20 111.76,122.94 114.3,125.48 114.3,137.67 C12.1 114.81,139.95 114.81,145.42 117.22,147.83 138.56,147.83 147.45,147.83 151.26,144.02 151.26,102.62 151.26,101.73 150.11,100.58 151.26,99.44 151.26,78.49 147.57,74.8 117.35,74.8 113.67,78.49 83.44,78.49 78.49,83.44 78.49,109.47 | JP3.10 133.1,91.95 D1.C | 132.97,92.08 R31.2 | OK7.6 47.63,86.49 46.86,87.25 46.86,90.8 47.63,91.57 OK7.8 61.72,91.57 63.88,93.73 | 63.88,93.73 63.88,101.98 63.88,110.74 | 63.88,110.74 63.88,112.14 63.88,116.97 63.88,122.05 63.88,130.94 | 63.88,130.94 OK5.5 | 63.88,110.74 OK4.5 | DIS1.15 78.62,109.34 78.49,109.47 | 78.49,109.47 78.49,141.35 79.5,142.37 DIS1.2 83.31,142.36 83.69,142.75 JP7.7 | 63.88,93.73 68.07,89.54 68.07,83.19 65.91,81.03 39.12,81.03 35.69,84.45 25.65,84.45 24,82.8 JP9.3
  Bottom 1.016: 139.83,91.82 144.15,91.82 144.78,92.46 144.78,99.82 145.54,100.58 150.11,100.58
  Bottom 1.27: JP2.3 JP2.4 202.82,55.5 202.82,58.55 201.68,59.69 193.8,59.69 190.63,56.52 190.63,37.72 197.74,30.61 C25.1 | C25.1 234.82,26.04 IC3.OUT 235.33,23.11 233.81,21.59 230.25,21.59 228.22,19.56 JP10.4 JP10.3 | C25.1 234.82,34.29 C24.+
  Bottom 1.676: JP8.7 JP8.8 | JP4.9 JP4.10 | JP1.3 JP1.4 | JP3.9 JP3.10 | JP7.7 JP7.8 | JP9.3 JP9.4
GND  (via drill 0.01 pad 1.42)  (3 unrouted)
  Top 0.61: v187.07,145.29 v187.07,150.37 | v187.07,138.56 v187.07,143.64 | v187.07,131.7 v187.07,136.78 | v187.07,124.97 v187.07,130.05 | v187.07,118.36 v187.07,123.44 | v187.07,111.63 v187.07,116.71 | v187.07,96.01 v187.07,101.09 | v147.07,98.3 v147.07,103.38 | v145.16,150.37 v145.16,144.78
  Bottom 0.61: 110.87,125.48 111.63,126.24 111.63,139.19 | 111.63,142.49 111.63,139.19 | C18.1 C19.1 137.67,121.67 137.54,117.22 137.54,116.59 138.43,115.7 138.43,108.08 139.45,107.06 139.45,102.62 | 139.45,102.49 139.45,94.74 JP3.11 JP3.12 | 139.45,102.49 139.45,102.62 | v187.07,150.37 Q7.1 | v187.07,145.29 v187.07,143.64 Q1.1 | v187.07,138.56 v187.07,136.78 Q6.1 | v187.07,131.7 v187.07,130.05 Q9.1 | v187.07,124.97 v187.07,123.44 Q8.1 | v187.07,118.36 v187.07,116.71 Q10.1 | v187.07,101.09 187.07,109.98 | 187.07,109.98 v187.07,111.63 | 186.18,94.49 JP4.11 | 186.18,94.49 187.71,92.96 R15.2 R16.2 R17.2 R18.2 189.87,79.63 200.03,79.63 200.15,79.63 | 200.03,78.61 JP1.1 | 187.07,109.98 Q11.1 | 139.45,102.62 C7.- | v147.07,98.3 147.07,81.66 145.29,79.88 LED2.K LED1.K 101.85,79.88 99.31,82.42 83.82,82.42 81.79,84.45 81.79,93.6 83.19,95 Q3.1 85.47,94.87 | 139.45,102.49 146.3,102.49 | C12.2 111.51,139.06 111.63,139.19 | 111.63,142.49 111.63,145.29 116.84,150.5 145.03,150.5 v145.16,150.37 | v145.16,144.78 145.16,143.13 144.78,142.75 | DIS1.1 83.95,147.83 83.95,151.26 84.58,151.89 105.16,151.89 108.46,148.59 108.46,145.67 111.63,142.49 | v187.07,96.01 187.07,95.38 186.18,94.49
  Bottom 0.813: R25.2 IC1.19 110.87,125.48 | IC1.8 121.03,120.4 122.05,119.38 130.81,119.38 C19.1 | OK7.2 44.32,89.03 44.96,88.39 44.96,84.71 44.2,83.95 42.42,83.95 | 42.42,83.95 OK7.4 | JP9.5 21.46,82.8 24.77,86.11 36.58,86.11 38.74,83.95 42.42,83.95
  Bottom 1.27: 238.63,30.61 237.87,29.84 IC3.GND 237.74,25.4 237.74,21.72 234.82,18.8 C22.2 231.78,18.8 230.76,17.78 JP10.6 JP10.5 230.76,9.65 229.74,8.64 220.34,8.64 218.19,10.8 C23.- B1.- | 238.63,30.61 C24.- 238.63,37.47 237.62,38.48 197.23,38.48 193.55,42.16 193.55,52.83 194.82,54.1 200.03,54.1 | 238.63,30.61 C25.2 | 200.03,54.1 200.15,54.1 JP2.2 | JP2.1 200.03,52.83 200.03,54.1
  Bottom 1.676: 200.15,79.63 JP1.2 | 200.03,79.63 200.03,78.61 | JP4.11 JP4.12 | JP9.6 JP9.5
  pour Bottom (isolate 1.27, no thermals): 77.47,154.05 77.47,72.77 153.29,72.77 153.29,153.8
  pour Bottom (isolate 1.422, no thermals): 199.77,72.26 156.59,72.39 156.59,153.54 193.93,153.54 194.06,96.14 205.23,96.14 205.23,72.26
N$1  (via drill 0.01 pad 1.42)
  Top 0.61: v23.49,108.46 v28.58,108.46
  Bottom 0.61: v28.58,108.46 29.85,108.46 30.99,109.6 R7.1
  Bottom 0.813: v23.49,108.46 D14.C R1.2 22.48,112.01 C1.+
N$2
  Bottom 0.61: R9.3 41.91,95.5 | 41.91,95.5 IC4.8 | 41.91,95.5 R35.2 54.23,95.5 55.24,96.52 R34.1
  Bottom 0.813: D15.A 18.41,98.3 18.92,98.81 18.92,103.38 | 18.92,108.46 18.92,103.38 | 18.92,108.46 D14.A | 18.92,103.38 D13.A | C3.- C2.- C1.- | R9.3 R8.3 R7.3 36.07,114.17 | 18.92,114.17 18.92,108.46 | 18.92,114.17 36.07,114.17 | 36.07,114.17 C9.- | 18.92,114.17 16.76,114.17 15.49,115.44 15.49,120.4 18.87,120.4 D8.A 24.18,120.45 D3.A
  Bottom 1.016: X2.1 6.86,119.76 8.76,121.67 14.22,121.67 15.49,120.4
  pour Bottom (isolate 1.422, no thermals): 2.29,97.16 18.8,97.16 22.61,93.35 61.6,93.35 61.47,113.16 58.8,113.28 53.72,115.82 48.13,121.41 16.51,121.41 14.22,123.7 1.14,123.7 1.14,98.3
N$3
  Bottom 1.27: X1.3 243.71,88.52 240.16,84.96 238.25,84.96 238.13,85.09 F1.2A
N$4  (via drill 0.01 pad 1.42)
  Top 0.61: v23.49,105.92 v28.58,105.92
  Bottom 0.61: v28.58,105.92 29.97,105.92 30.99,104.9 R8.1
  Bottom 0.813: v23.49,105.92 R2.2 D13.C 22.23,102.62 C2.+
N$5  (via drill 0.01 pad 1.42)
  Top 0.61: v33.53,108.46 v38.61,108.46
  Bottom 0.61: R7.2 v33.53,108.46 | v38.61,108.46 41.15,108.46 41.91,107.7 IC4.5
N$6  (via drill 0.01 pad 1.42)
  Top 0.61: v23.62,99.19 v28.7,99.19
  Bottom 0.61: D15.C 21.46,99.19 | v28.7,99.19 29.46,99.19 30.99,97.66 R9.1
  Bottom 0.813: R3.2 D15.C 21.46,96.52 22.48,95.5 C3.+ | 21.46,99.19 v23.62,99.19
N$7  (via drill 0.01 pad 1.42)
  Top 0.61: v38.61,99.19 v33.53,99.19
  Bottom 0.61: v33.53,99.19 R9.2 | v38.61,99.19 38.61,99.82 39.37,100.58 IC4.7
N$8
  Bottom 0.813: X2.3 D5.A
N$9
  Bottom 0.813: D6.C R3.1
N$10
  Bottom 0.813: X2.4 D6.A
N$11
  Bottom 0.813: D5.C R2.1
N$12
  Bottom 0.813: X2.2 D32.A 11,114.12 12.19,115.32 C8.1
N$13
  Bottom 0.813: D32.C R1.1
N$14
  Bottom 0.813: X6.3 D9.A
N$15  (via drill 0.01 pad 1.42)
  Top 0.61: v38.61,105.92 v33.53,105.92
  Bottom 0.61: v33.53,105.92 R8.2 | v38.61,105.92 38.61,104.27 39.75,103.12 IC4.6
N$16  (via drill 0.01 pad 1.42)
  Top 0.61: v23.37,138.3 v28.45,138.3
  Bottom 0.61: v28.45,138.3 30.35,138.3 30.99,138.94 R10.1
  Bottom 0.813: v23.37,138.3 D17.C R4.2 22.99,140.84 C4.+
N$17
  Bottom 1.27: B1.AC1 196.09,10.8 193.68,13.21 U$18.P$3
N$18
  Bottom 0.61: R19.2 OK4.2
N$19
  Bottom 0.61: IC4.3 R34.2 56.77,104.65 OK2.5
N$20
  Bottom 0.61: OK2.7 57.53,99.57 56.52,100.58 R35.1 IC4.2
N$21
  Bottom 0.813: 61.47,102.23 61.47,97.92 60.58,97.03 OK2.8 | 61.47,102.23 61.47,112.52 60.71,113.28 OK4.1 49.53,113.28 C9.+ | OK2.6 61.34,102.11 61.47,102.23 | D19.C 29.39,120.47 D3.C 46.86,120.52 48.64,118.75 C9.+ | C9.+ 46.86,112.39 46.86,99.31 48.13,98.04 IC4.1
N$22
  Bottom 0.61: 26.67,145.29 C4.- | R12.3 41.78,124.59 41.91,124.71 IC2.8 | D17.A 18.92,138.3 18.92,138.68 | D20.A 18.92,133.22 18.92,133.48
  Bottom 0.813: C6.- C5.- C4.- | R12.3 R11.3 R10.3 36.07,145.29 | 16.89,150.5 16.89,146.43 18.03,145.29 18.92,145.29 | 16.89,150.5 17.91,151.51 19.64,151.51 D11.A 24.59,151.56 D4.A | 36.07,145.29 26.67,145.29 18.92,145.29 | 36.07,145.29 C11.- | X6.1 6.86,149.73 8.76,151.64 15.75,151.64 16.89,150.5 | D18.A 18.16,128.02 18.92,128.78 18.92,133.48 18.92,138.68 18.92,145.29
  Bottom 1.016: R37.2 R39.2
  pour Bottom (isolate 1.422, no thermals): 1.65,126.49 14.99,126.49 18.67,122.81 47.63,122.55 52.2,117.86 57.53,117.86 57.53,150.24 54.61,153.16 0.51,153.04 0.51,127.89
N$23  (via drill 0.01 pad 1.42)
  Top 0.61: v68.96,113.54 v74.17,113.54
  Bottom 0.61: JP8.6 69.6,145.29 71.88,143 71.88,121.92 74.17,119.63 v74.17,113.54 | v68.96,113.54 68.96,109.35 67.82,108.2 OK4.4
  Bottom 1.676: JP8.6 JP8.5
N$24
  Bottom 1.27: B1.AC2 200.91,8.26 200.91,14.22 202.44,15.75 217.3,15.75 219.08,17.53 U$18.P$4
N$25  (via drill 0.01 pad 1.42)
  Top 0.61: v23.37,135.76 v28.45,135.76
  Bottom 0.61: v28.45,135.76 30.48,135.76 30.99,135.25 R11.1
  Bottom 0.813: v23.37,135.76 R5.2 D20.C 23.11,133.22 C5.+
N$26
  Bottom 0.813: R13.2 38.99,117.09 C8.2
N$27  (via drill 0.01 pad 1.42)
  Top 0.61: v23.49,128.52 v28.58,128.52
  Bottom 0.61: v28.58,128.52 30.35,128.52 30.99,127.89 R12.1 | 23.24,124.84 23.24,124.71
  Bottom 0.813: 23.24,124.71 C6.+ | 23.24,124.84 21.46,126.62 D18.C 21.46,129.29 | 21.46,129.29 R6.2 | v23.49,128.52 22.99,128.52 22.23,129.29 21.46,129.29
N$28
  Bottom 0.813: D8.C 18.97,117.09 R13.1 D19.A
N$29
  Bottom 0.61: JP8.3 58.8,147.83 58.17,148.46 58.17,151.76 59.05,152.65 73.91,152.65 75.69,150.88 75.69,104.9 74.8,104.01 69.09,104.01 68.45,104.65 OK2.4
  Bottom 1.676: JP8.3 JP8.4
N$30
  Bottom 0.813: D10.C R6.1
N$31
  Bottom 0.813: D9.C R5.1
N$32  (via drill 0.6 pad 1.78)
  Top 0.61: v206.88,108.08 v206.88,152.27
  Bottom 1.27: 197.36,151 AB-GR.P$3 | v206.88,108.08 199.01,108.08 CE-GR.P$3
  Bottom 1.676: 216.53,152.27 233.68,152.27 | 233.68,152.27 243.21,152.27 245.36,150.11 X4.10 | 233.68,152.27 CE-LI.P$3 | 216.53,152.27 AB-LI.P$3 | 216.53,152.27 v206.88,152.27 198.63,152.27 197.36,151
N$33
  Bottom 0.813: D7.C R4.1
N$34  (via drill 0.01 pad 1.42)
  Top 0.61: v71.88,102.11 v71.88,107.19
  Bottom 0.61: JP8.10 68.33,140.21 70.49,138.05 70.49,121.41 72.26,119.63 72.26,108.84 71.88,108.46 v71.88,107.19 | OK2.2 70.61,99.57 71.88,100.84 v71.88,102.11
  Bottom 1.676: JP8.10 JP8.9
N$35
  Bottom 0.813: X6.2 D7.A 11,143.46 12.19,144.65 C10.1
N$36
  Bottom 0.813: X6.4 D10.A
N$37
  Bottom 0.61: R41.2 109.09,88.01 111.12,85.98 130.3,85.98 134.49,81.79 JP3.2
  Bottom 1.676: JP3.2 JP3.1
N$38  (1 unrouted)
  Bottom 0.61: R38.1 54.48,134.24 57.79,130.94
N$39
  Bottom 0.61: IC1.1 D2.C
N$40
  Bottom 0.61: IC1.10 122.3,125.48 Q2.1 C18.2
N$41  (via drill 0.01 pad 1.42)
  Top 0.61: v68.71,124.59 v73.79,124.59
  Bottom 0.61: JP8.2 69.22,150.37 73.79,145.8 v73.79,124.59 | OK1.4 v68.71,124.59
  Bottom 1.676: JP8.2 JP8.1
N$42
  Bottom 0.61: IC1.9 122.05,122.94 Q2.2 C19.2
N$43
  Bottom 0.61: Q1.2 178.05,142.37 177.55,141.86 177.55,139.83 177.29,139.57
  Bottom 1.676: JP6.1 177.29,139.57 JP6.2
N$44
  Bottom 0.61: DIS1.16 R32.2
N$45
  Bottom 0.61: DIS1.14 88.52,111.89 97.79,102.62 IC1.28 109.35,100.33 109.09,100.08 R41.1
N$47
  Bottom 0.61: DIS1.13 89.16,114.42 98.43,105.16 IC1.27 111.12,105.16 111.38,104.9 R42.1
N$49
  Bottom 1.676: AB-GR.P$4 202.69,136.14 208.28,132.59 240.03,132.59 242.57,130.05 X4.7
N$51
  Bottom 1.676: AB-LI.P$4 221.36,136.14 225.42,140.21 X4.9
N$52
  Bottom 1.27: 244.35,136.14 X4.8
  Bottom 1.676: CE-LI.P$4 244.35,136.14
N$53
  Bottom 1.27: 243.71,119.89 X4.5
  Bottom 1.676: 243.71,119.89 PA-GR.P$4 MA-GR.P$4
N$54
  Bottom 0.61: JP6.4 180.47,137.03 Q6.2
  Bottom 1.676: JP6.3 JP6.4
N$55
  Bottom 0.61: JP6.5 174.5,134.49 173.99,135 173.99,147.7 175.39,149.1 Q7.2
  Bottom 1.676: JP6.5 JP6.6
N$56
  Bottom 0.61: JP6.7 174.88,131.95 174.12,131.19 174.12,120.65 179.96,114.81 179.96,110.49 181.74,108.71 Q11.2
  Bottom 1.676: JP6.7 JP6.8
N$57  (via drill 0.01 pad 1.42)
  Top 0.61: v33.53,138.43 v38.35,138.43
  Bottom 0.61: v33.53,138.43 R10.2 | v38.35,138.43 40.64,138.43 41.91,137.16 IC2.5
N$58
  Bottom 1.27: 243.84,124.97 X4.6
  Bottom 1.676: 243.84,124.97 240.03,128.78 205.61,128.78 203.33,126.49 CE-GR.P$4
N$59
  Bottom 0.61: C7.+ D2.A D1.A R31.1
N$60
  Bottom 1.27: C28.1 C26.1 | R45.2 230.25,46.36 C28.1 | JP2.12 JP2.11 212.85,50.29 213.68,49.47 | U$18.P$2 214,49.15 213.68,49.47 | C28.1 213.68,49.53 213.68,49.47
N$61
  Bottom 0.61: JP6.10 181.36,129.41 Q9.2
  Bottom 1.676: JP6.9 JP6.10
N$62
  Bottom 1.27: 243.84,114.81 X4.4
  Bottom 1.676: MA-GR.P$3 216.53,116.71 220.34,120.52 238.13,120.52 243.84,114.81
N$63
  Bottom 0.813: JP13.2 JP13.1 54.48,87.5 52.96,89.03 OK7.7
N$64  (via drill 0.01 pad 1.27)
  Top 0.61: v33.53,128.52 v38.61,128.52
  Bottom 0.61: R12.2 v33.53,128.52 | v38.61,128.52 38.99,128.52 40.13,129.67 IC2.7
N$66
  Bottom 1.016: X1.2 248.67,83.44 250.19,81.92 250.19,76.45 248.28,74.55 211.71,74.55 210.31,75.95 210.31,77.98 JP1.9
  Bottom 1.676: 210.31,77.98 JP1.10
N$67
  Bottom 0.61: LED1.A 103,82.42 100.46,84.96 R44.1
N$68
  Bottom 0.61: DIS1.3 81.54,139.82 95.89,125.48 R25.1 R27.2
N$69
  Bottom 0.61: R47.2 116.59,89.66 133.35,89.66 133.6,89.41 JP3.8
  Bottom 1.676: JP3.8 JP3.7
N$70
  Bottom 0.61: JP3.6 133.48,86.87 132.08,88.27 114.3,88.27 113.79,88.77 R43.2
  Bottom 1.676: JP3.6 JP3.5
N$71
  Bottom 0.61: DIS1.12 89.28,117.09 98.55,107.82 IC1.26 112.01,107.7 113.03,106.68 113.03,100.46 113.79,99.7 R43.1
N$72
  Bottom 0.61: DIS1.11 89.92,119.51 99.19,110.24 IC1.25 113.03,110.24 114.81,108.46 114.81,100.84 116.21,99.44 R47.1
N$74
  Bottom 0.61: DIS1.4 82.05,137.28 100.08,119.25 106.05,119.25 107.19,120.4 IC1.21
N$75
  Bottom 0.61: IC1.22 99.57,117.86 82.8,134.62 81.14,134.62 DIS1.5
N$76
  Bottom 0.61: DIS1.6 81.14,132.08 83.31,132.08 100.08,115.32 IC1.23
N$77
  Bottom 0.61: R50.1 IC1.17
N$78
  Bottom 0.61: IC1.16 105.54,133.1 102.62,136.02 R49.1
N$79
  Bottom 0.61: IC1.15 107.19,135.64 106.3,136.53 R48.1
N$80  (1 unrouted)
  Bottom 1.27: 212.85,80.26 212.85,83.57 214.5,85.22 222,85.22 222.38,85.6 F1.1A
  Bottom 1.676: JP1.11 212.85,80.26
N$82  (via drill 0.01 pad 1.42)
  Top 0.61: v100.46,128.02 v105.54,128.02
  Bottom 0.61: v105.54,128.02 IC1.18 | JP7.12 R51.2 93.85,133.35 99.19,128.02 v100.46,128.02
  Bottom 1.676: JP7.11 JP7.12
N$83
  Bottom 0.61: IC4.4 R19.1
N$84
  Bottom 0.61: JP5.1 141.1,124.33 141.99,123.44 141.99,118.49 141.35,117.86 R22.2
  Bottom 1.676: JP5.1 JP5.2
N$85
  Bottom 0.61: LED2.A 127.64,82.55 125.6,84.58 103.25,84.58 100.33,87.5 R46.1
N$86
  Bottom 0.61: Q3.3 R32.1
N$87
  Bottom 0.61: Q3.2 R33.2
N$88
  Bottom 1.016: U$18.P$1 198.88,46.48 198.88,48.9 199.64,49.66 209.3,49.66 210.31,50.67 JP2.9 JP2.10
  Bottom 1.27: U$18.P$1 198.75,43.69 200.41,42.04 231.01,42.04 233.81,44.83 R45.1 238,48.77 C26.2 C27.2
N$89
  Bottom 0.406: 78.1,151.64 78.1,152.91 80.01,152.91
N$90
  Bottom 1.27: 243.84,109.73 X4.3
  Bottom 1.676: PA-GR.P$3 234.95,108.46 242.57,108.46 243.84,109.73
N$91
  Bottom 0.406: 75.56,153.54 76.84,153.54 76.84,152.27
N$92
  Bottom 1.676: ALARMA.P$3 227.2,97.66 234.19,104.65 X4.2
N$93
  Bottom 0.61: JP6.12 179.83,126.87 180.97,125.73 180.97,123.19 Q8.2
  Bottom 1.676: JP6.11 JP6.12
N$94
  Bottom 0.813: X5.2 10.16,84.96 11.68,86.49 R21.1
N$95
  Bottom 0.61: JP6.14 178.69,118.75 Q10.2
  Bottom 1.676: JP6.14 JP6.13
N$96
  Bottom 0.61: IC1.14 120.14,135.64 124.08,139.57 R30.1
N$97
  Bottom 0.61: IC1.13 120.14,133.1 124.08,137.03 R29.1
N$98
  Bottom 0.61: IC1.12 120.14,130.56 124.08,134.49 R28.1
N$99
  Bottom 0.61: IC1.11 120.27,128.02 124.21,131.95 R26.1
N$100
  Bottom 0.61: IC1.4 R24.1
N$101
  Bottom 0.61: IC1.5 R23.1
N$102
  Bottom 0.61: S1.1 162.69,135.76 164.34,135.76 165.86,134.24 165.86,120.27 170.31,115.82 170.31,91.06 171.96,89.41 JP4.8
  Bottom 0.813: JP4.7 R15.1
  Bottom 1.676: JP4.8 JP4.7
N$103
  Bottom 0.61: S2.1 160.05,121.51 161.16,120.4 163.83,120.4 168.91,115.32 168.78,90.93 168.78,90.3 172.21,86.87 JP4.6
  Bottom 0.813: JP4.5 R16.1
  Bottom 1.676: JP4.6 JP4.5
N$104
  Bottom 0.61: S3.1 160.05,106.15 160.4,105.79 166.24,105.79 167.26,104.78 167.26,89.66 172.59,84.33 JP4.4
  Bottom 0.813: JP4.3 R17.1
  Bottom 1.676: JP4.4 JP4.3
N$105
  Bottom 0.61: S4.1 160.05,90.65 161.16,89.54 164.72,89.54 172.47,81.79 JP4.2
  Bottom 0.813: JP4.1 R18.1
  Bottom 1.676: JP4.2 JP4.1
N$106
  Bottom 0.61: IC1.7 R22.1
N$107
  Bottom 0.813: X5.1 R20.1
N$108
  Bottom 0.406: 151.51,152.91 152.65,152.91 152.65,151.64
N$109
  Bottom 0.406: 151.51,72.9 152.65,72.9 152.65,74.17
N$110
  Bottom 0.406: 157.86,72.26 156.59,72.26 156.59,73.53
N$111
  Bottom 0.406: 156.59,152.53 156.59,153.54 157.48,153.54
N$112
  Bottom 0.406: 250.83,72.26 252.09,72.26 252.09,73.53
N$113
  Bottom 0.406: 250.83,153.54 252.09,153.54 252.09,152.27
N$114
  Bottom 0.406: 0,152.27 0,153.54 1.27,153.54
N$115
  Bottom 0.406: 1.27,72.26 0,72.26 0,73.53
N$116
  Bottom 0.406: 74.93,72.26 76.84,72.26 76.84,74.17
N$117
  Bottom 0.406: 80.65,72.9 78.1,72.9 78.1,75.44
N$118
  Bottom 0.61: IC2.2 50.8,129.67 53.59,126.87 53.59,120.9 54.23,120.27 R37.1 56.77,119.51 OK1.7
N$119
  Bottom 0.61: R38.2 50.29,139.32 49.53,138.56 IC2.4
N$120
  Bottom 1.676: ALARMA.P$4 236.47,98.04 238,99.57 X4.1
N$121
  Bottom 0.61: IC2.3 51.05,132.21 56.01,127.25 56.01,124.59 | R39.1 56.01,124.59 | 56.01,124.59 OK1.5
N$122
  Bottom 0.813: OK7.1 38.99,91.57 37.46,90.04 R20.2
N$123
  Bottom 0.813: R21.2 21.97,86.49 23.62,88.14 37.72,88.14 39.37,86.49 OK7.3
N$124
  Bottom 0.813: ALARMA.P$1 223.34,103.63 D27.A 218.62,99.31 185.29,99.31 183.9,100.71 Q11.3
N$125
  Bottom 0.61: 61.21,121.92 61.09,122.05 | 49.15,144.78 C11.+
  Bottom 0.813: OK1.8 60.71,116.97 61.21,117.48 61.21,121.92 61.21,132.72 60.45,133.48 OK5.1 57.66,133.48 56.64,134.49 56.64,140.59 54.23,143 50.93,143 49.15,144.78 47.12,142.75 47.12,127.51 47.5,127.13 IC2.1 | 61.09,122.05 OK1.6 | D12.C 29.77,151.46 D4.C 47.37,151.51 49.15,149.73 C11.+
N$126
  Bottom 0.813: D11.C 22.68,148.16 R14.1 D12.A
N$127
  Bottom 1.016: R14.2 C10.2
N$128
  Bottom 0.61: PA-GR.P$1 227.71,113.54 228.35,114.17 D26.A
  Bottom 0.813: PA-GR.P$1 227.71,111 218.82,102.11 | Q10.3 187.96,114.17 188.85,113.28 188.85,104.52 192.28,101.09 217.81,101.09 218.82,102.11 | 218.82,102.11 218.57,101.85
N$129  (via drill 0.01 pad 1.42)
  Top 0.61: v33.53,135.64 v38.35,135.64
  Bottom 0.61: R11.2 v33.53,135.64 | v38.35,135.64 38.35,133.48 39.62,132.21 IC2.6
N$130
  Bottom 0.61: JP14.2 R46.2 94.87,87.5 99.57,92.2 126.11,92.2 127.51,93.6 127.51,105.66 129.03,107.19 135.64,107.19 136.78,108.33 136.78,114.43 135.89,115.32 IC1.6
  Bottom 1.676: JP14.1 JP14.2
N$133
  Bottom 0.813: D25.A MA-GR.P$1 210.57,118.36 208.79,120.14 200.15,120.14 198.5,121.79 198.5,125.35 196.34,127.51 Q9.3
N$137
  Bottom 0.61: JP14.3 84.2,84.96 83.31,85.85 83.31,89.03 84.46,90.17 95.25,90.17 98.68,93.6 124.71,93.6 125.98,94.87 125.98,105.66 123.95,107.7 IC1.3 | 89.41,85.09 89.28,84.96 JP14.4 R44.2
  Bottom 1.676: JP14.3 JP14.4
N$138
  Bottom 0.813: CE-GR.P$1 191.34,111.71 | D24.A CE-GR.P$1 | Q8.3 189.87,120.9 191.39,119.38 CE-GR.P$1
N$139
  Bottom 0.813: JP13.4 JP13.3 58.04,84.96 57.02,83.95 OK7.5
N$140
  Bottom 0.813: AB-GR.P$1 203.33,146.18 200.99,143.84 D23.A 190.17,143.84 189.1,144.91 189.1,146.43 187.71,147.83 Q7.3
N$141
  Bottom 0.61: JP5.3 142.37,126.87 143.76,125.48 143.76,114.05 142.49,112.78 R23.2
  Bottom 1.676: JP5.3 JP5.4
N$142
  Bottom 0.813: CE-LI.P$1 239.65,146.81 236.55,143.72 D22.A 225.12,143.72 220.98,139.57 189.23,139.57 188.59,138.94 188.59,134.75 188.09,134.24 Q6.3
N$143
  Bottom 0.61: JP5.5 143.26,129.41 145.54,127.13 145.54,112.01 143.76,110.24 R24.2
  Bottom 1.676: JP5.5 JP5.6
N$144
  Bottom 0.813: AB-LI.P$1 222.63,148.21 222.63,145.67 220.55,143.59 D21.A 207.47,143.59 205.36,141.48 189.61,141.48 189.23,141.1 Q1.3
N$145
  Bottom 0.61: R26.2 JP5.8
  Bottom 1.676: JP5.8 JP5.7
N$146
  Bottom 0.61: R28.2 JP5.10
  Bottom 1.676: JP5.10 JP5.9
N$147
  Bottom 0.61: R29.2 JP5.12
  Bottom 1.676: JP5.12 JP5.11
N$148
  Bottom 0.61: R30.2 JP5.14
  Bottom 1.676: JP5.14 JP5.13
N$149  (via drill 0.01 pad 1.42)
  Top 0.61: v73.91,102.11 v73.91,107.19
  Bottom 0.61: OK1.2 70.23,119.51 70.87,118.87 70.87,109.22 69.72,108.08 69.72,106.05 70.49,105.28 73.53,105.28 73.91,105.66 v73.91,107.19 | OK2.1 71.75,97.03 73.91,99.19 v73.91,102.11
N$151
  Bottom 0.61: R48.2 106.3,144.4 101.22,149.48 91.95,149.48 91.06,150.37 JP7.2
  Bottom 1.676: JP7.1 JP7.2
N$152
  Bottom 0.61: 96.9,95.89 R33.1 97.92,94.87 123.57,94.87 124.33,95.63 124.33,104.14 123.32,105.16 IC1.2
N$153
  Bottom 0.61: JP7.4 99.95,147.83 102.62,145.16 R49.2
  Bottom 1.676: JP7.3 JP7.4
N$154
  Bottom 0.61: R50.2 98.93,130.56 95.63,133.86 95.63,138.56 93.98,140.21 JP7.10
  Bottom 1.676: JP7.9 JP7.10
N$155
  Bottom 0.61: LED3.A R40.1
N$156
  Bottom 0.61: JP3.4 134.11,84.33 131.32,87.12 112.65,87.12 111.38,88.39 R42.2
  Bottom 1.676: JP3.4 JP3.3
N$157
  Bottom 0.61: JP8.12 67.82,137.67 68.96,136.53 68.96,128.91 68.45,128.4 OK5.4
  Bottom 1.676: JP8.12 JP8.11
N$158  (via drill 0.01 pad 1.42)
  Top 0.61: v103,113.41 v103,121.03
  Bottom 0.61: v103,121.03 103,131.7 101.35,133.35 98.68,133.35 97.03,135 97.03,139.57 R52.1 91.31,145.29 JP7.6 | v103,113.41 103.63,112.78 IC1.24
  Bottom 1.676: JP7.6 JP7.5
V+  (via drill 0.01 pad 1.42)  (2 unrouted)
  Top 0.813: v205.23,97.79 v205.23,102.87
  Bottom 0.61: ALARMA.P$2 220.09,91.69 218.82,92.96 D27.C | D27.C 218.82,95.89 219.08,96.14 219.08,95.96 D27.C
  Bottom 0.813: PA-GR.P$2 239.65,113.92 236.6,116.97 234.82,116.97 | 234.82,116.97 224.28,116.97 222.5,115.19 MA-GR.P$2 222.5,109.86 218.31,105.66 210.74,105.66 D25.C 205.23,105.49 | D26.C 234.75,116.89 234.82,116.97 | CE-GR.P$2 200.79,111.76 199.39,113.16 195.45,113.16 193.93,111.63 193.93,105.49 | D22.C 228.93,147.12 CE-LI.P$2 225.17,148.34 223.14,150.37 221.49,150.37 218.11,146.99 D21.C 211.91,146.99 AB-LI.P$2 206.5,148.34 204.47,150.37 202.31,150.37 199.14,147.19 194.23,147.19 D23.C 192.48,147.24 AB-GR.P$2 190.12,149.61 190.12,151.26 188.98,152.4 174.62,152.4 172.21,149.99 172.21,119.89 178.05,114.05 178.05,108.97 181.86,105.16 181.86,100.08 184.02,97.92 200.15,97.92 205.23,92.84 | 193.93,105.49 D24.C | 202.31,105.49 193.93,105.49 | 205.23,105.49 202.31,105.49 | 202.31,105.49 202.69,105.49 | 205.23,92.84 JP1.6 | 205.23,92.84 205.23,93.09 | 205.23,93.09 v205.23,97.79 | v205.23,102.87 205.23,105.49 | 219.08,96.14 208.28,96.14 205.23,93.09
  Bottom 1.27: JP2.5 JP2.6 205.23,60.07 202.56,62.74 193.04,62.74 188.21,57.91 188.21,10.8 193.29,5.72 B1.+ 198.37,3.68 199.77,2.29 207.14,2.29 210.57,5.72 C23.+ 231.14,5.72 233.3,7.87 JP10.7 JP10.8 237.87,14.35 239.14,15.62 C22.1 240.41,20.07 IC3.IN
  Bottom 1.422: X5.3 18.92,79.88 JP9.7
  Bottom 1.676: JP1.6 JP1.5 | JP9.7 JP9.8
(copper drawn outside any net)
  shapes: Bottom area x2

### Text on the board
Bottom: TA_PE_V1 | PA_PR_V1 | TA_FR_V1 | TA_PT_V1